# EasyEDA Pro project ProPrj_超级电容组-50F-11S-1P.epro

# Schematic capacitor_protection
Create Date: 2024-03-18; Page Name: P1; Project Name: 超级电容组-50F-11S-1P; Schematic Name: capacitor_protection; Update Date: 2024-04-27; Company: 嘉立创EDA; Page Size: A3; Version: V1.0
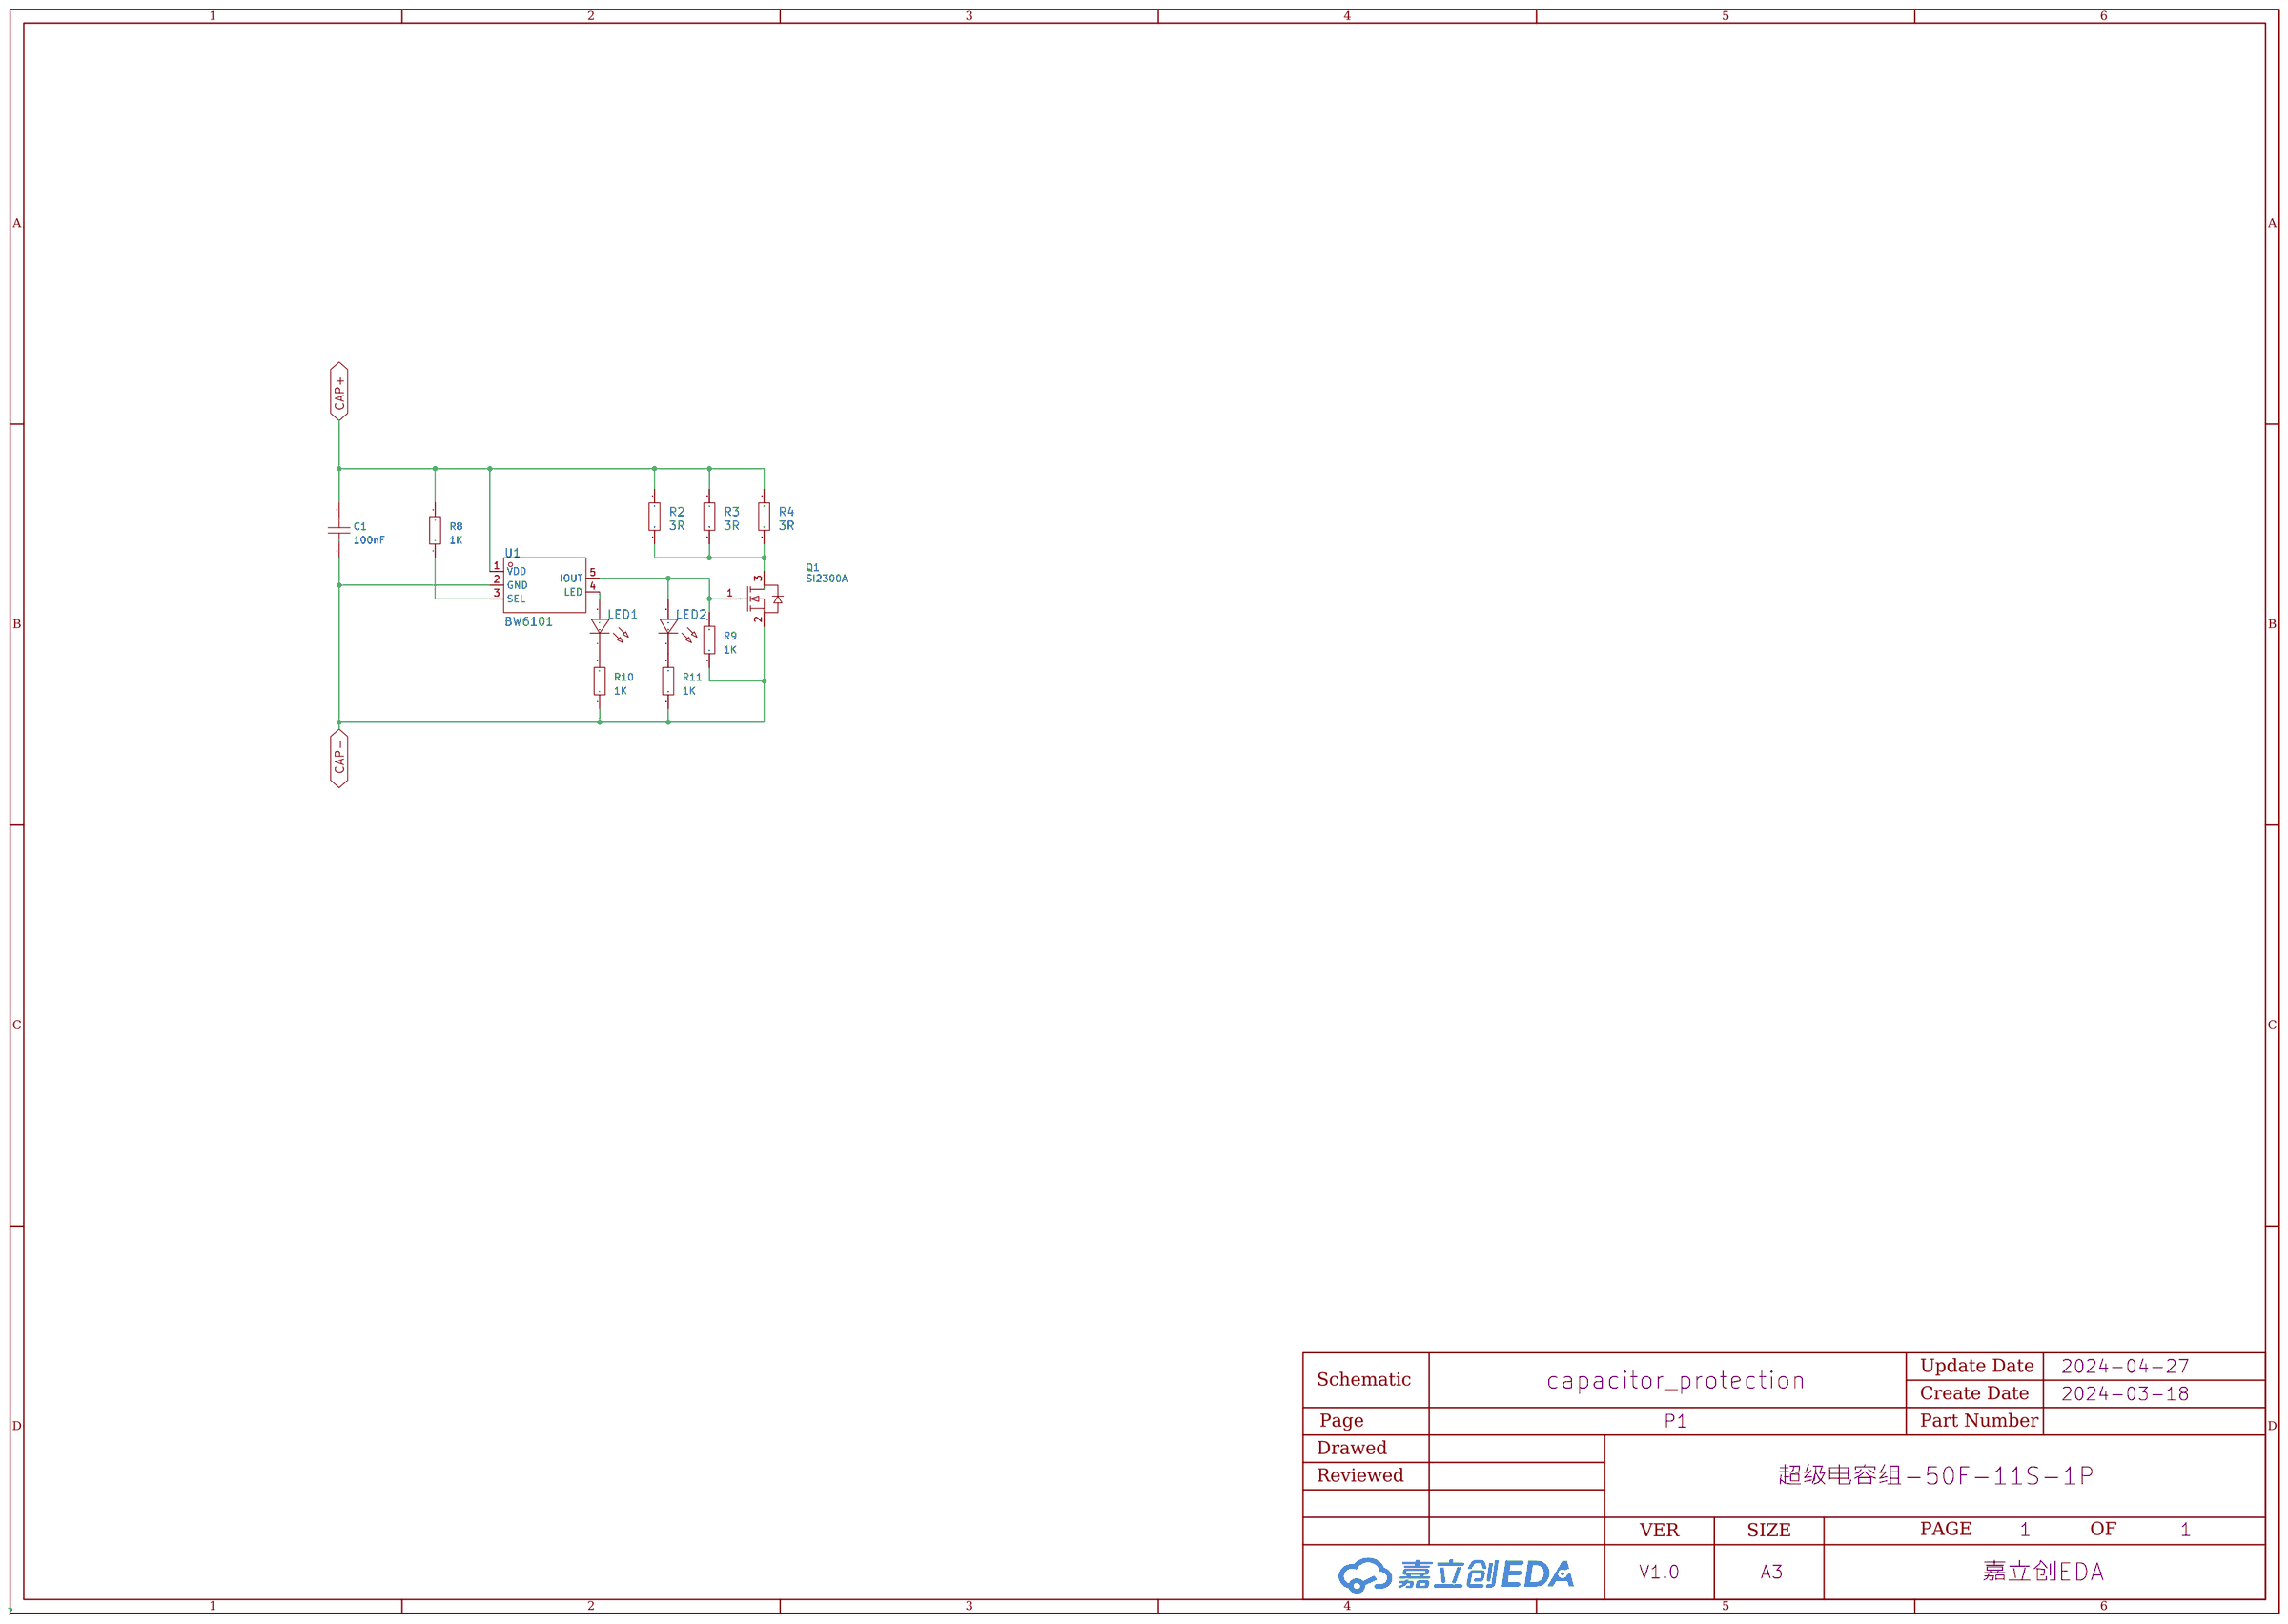
[diagram p0: schematic sheet]

## Parts
C1  100nF  [0603电容-简化]
LED1  -  [LED_0603]
LED2  -  [LED_0603]
Q1  SI2300A  [SOT-23-3_L2.9-W1.5-P1.90-LS2.6-BL]
R2  3R  [R2512_1]
R3  3R  [R2512_1]
R4  3R  [R2512_1]
R8  1K  [R0603]
R9  1K  [R0603]
R10  1K  [R0603]
R11  1K  [R0603]
U1  BW6101  [SOT-23-5_L2.9-W1.6-P0.95-LS2.8-BL_1]

## Library data of the parts
C1 = CC0603KRX7R9BB104: 容值:100nF;精度:±10%;额定电压:50V;材质(温度系数):X7R;; LCSC Part Name: 100nF ±10% 50V; Supplier Part: C14663; Manufacturer: YAGEO(国巨); Supplier Footprint: 0603; JLCPCB Part Class: Basic Part; Datasheet: https://atta.szlcsc.com/upload/public/pdf/source/20180910/C282072_33301C7F631E79921B82A8DAC6BCC5B3.pdf; Supplier: LCSC; Tolerance: ±10%; Voltage Rated: 50V; Temperature Coefficient: X7R
LED1 LED2 = LED_0603-R: Supplier Footprint: 0603
Q1 = SI2300A: Supplier Part: C347480; Manufacturer: UMW(广东友台半导体); Supplier Footprint: SOT-23; JLCPCB Part Class: Extended Part; Datasheet: https://atta.szlcsc.com/upload/public/pdf/source/20190109/C347480_B3D6AA9FA12487304E2E565AB1CA419C.pdf; Supplier: LCSC
R2-R4 = 25121WJ047JT4E_1: Supplier: LCSC; Manufacturer: UniOhm; Manufacturer Part: 25121WJ047JT4E; Supplier Part: C25489; Resistance: 4.7; JLCPCB Part Class: Extended Part
R8-R11 = Res_0603: Supplier Footprint: 0603
U1 = BW6101_1: Supplier: LCSC; Supplier Part: C2835089; Manufacturer: null; JLCPCB Part Class: Extended Part

## Nets
CAP+: C1.2 R2.1 R3.1 R4.1 R8.2 U1.1(VDD)
CAP-: C1.1 Q1.2(S) R9.1 R10.1 R11.1 U1.2(GND)
Net-(LED1-1): LED1.1(C) R10.2
Net-(LED1-2): LED1.2(A) U1.4(LED)
Net-(LED2-1): LED2.1(C) R11.2
Net-(LED2-2): LED2.2(A) Q1.1(G) R9.2 U1.5(IOUT)
Net-(Q1-3): Q1.3(D) R2.2 R3.2 R4.2
Net-(R8-1): R8.1 U1.3(SEL)

# Schematic Schematic1
Create Date: 2024-03-18; Page Name: P1; Project Name: 超级电容组-50F-11S-1P; Schematic Name: Schematic1; Update Date: 2024-04-17; Company: 嘉立创EDA; Drawed: Welt; Page Size: A4; Version: V1.0
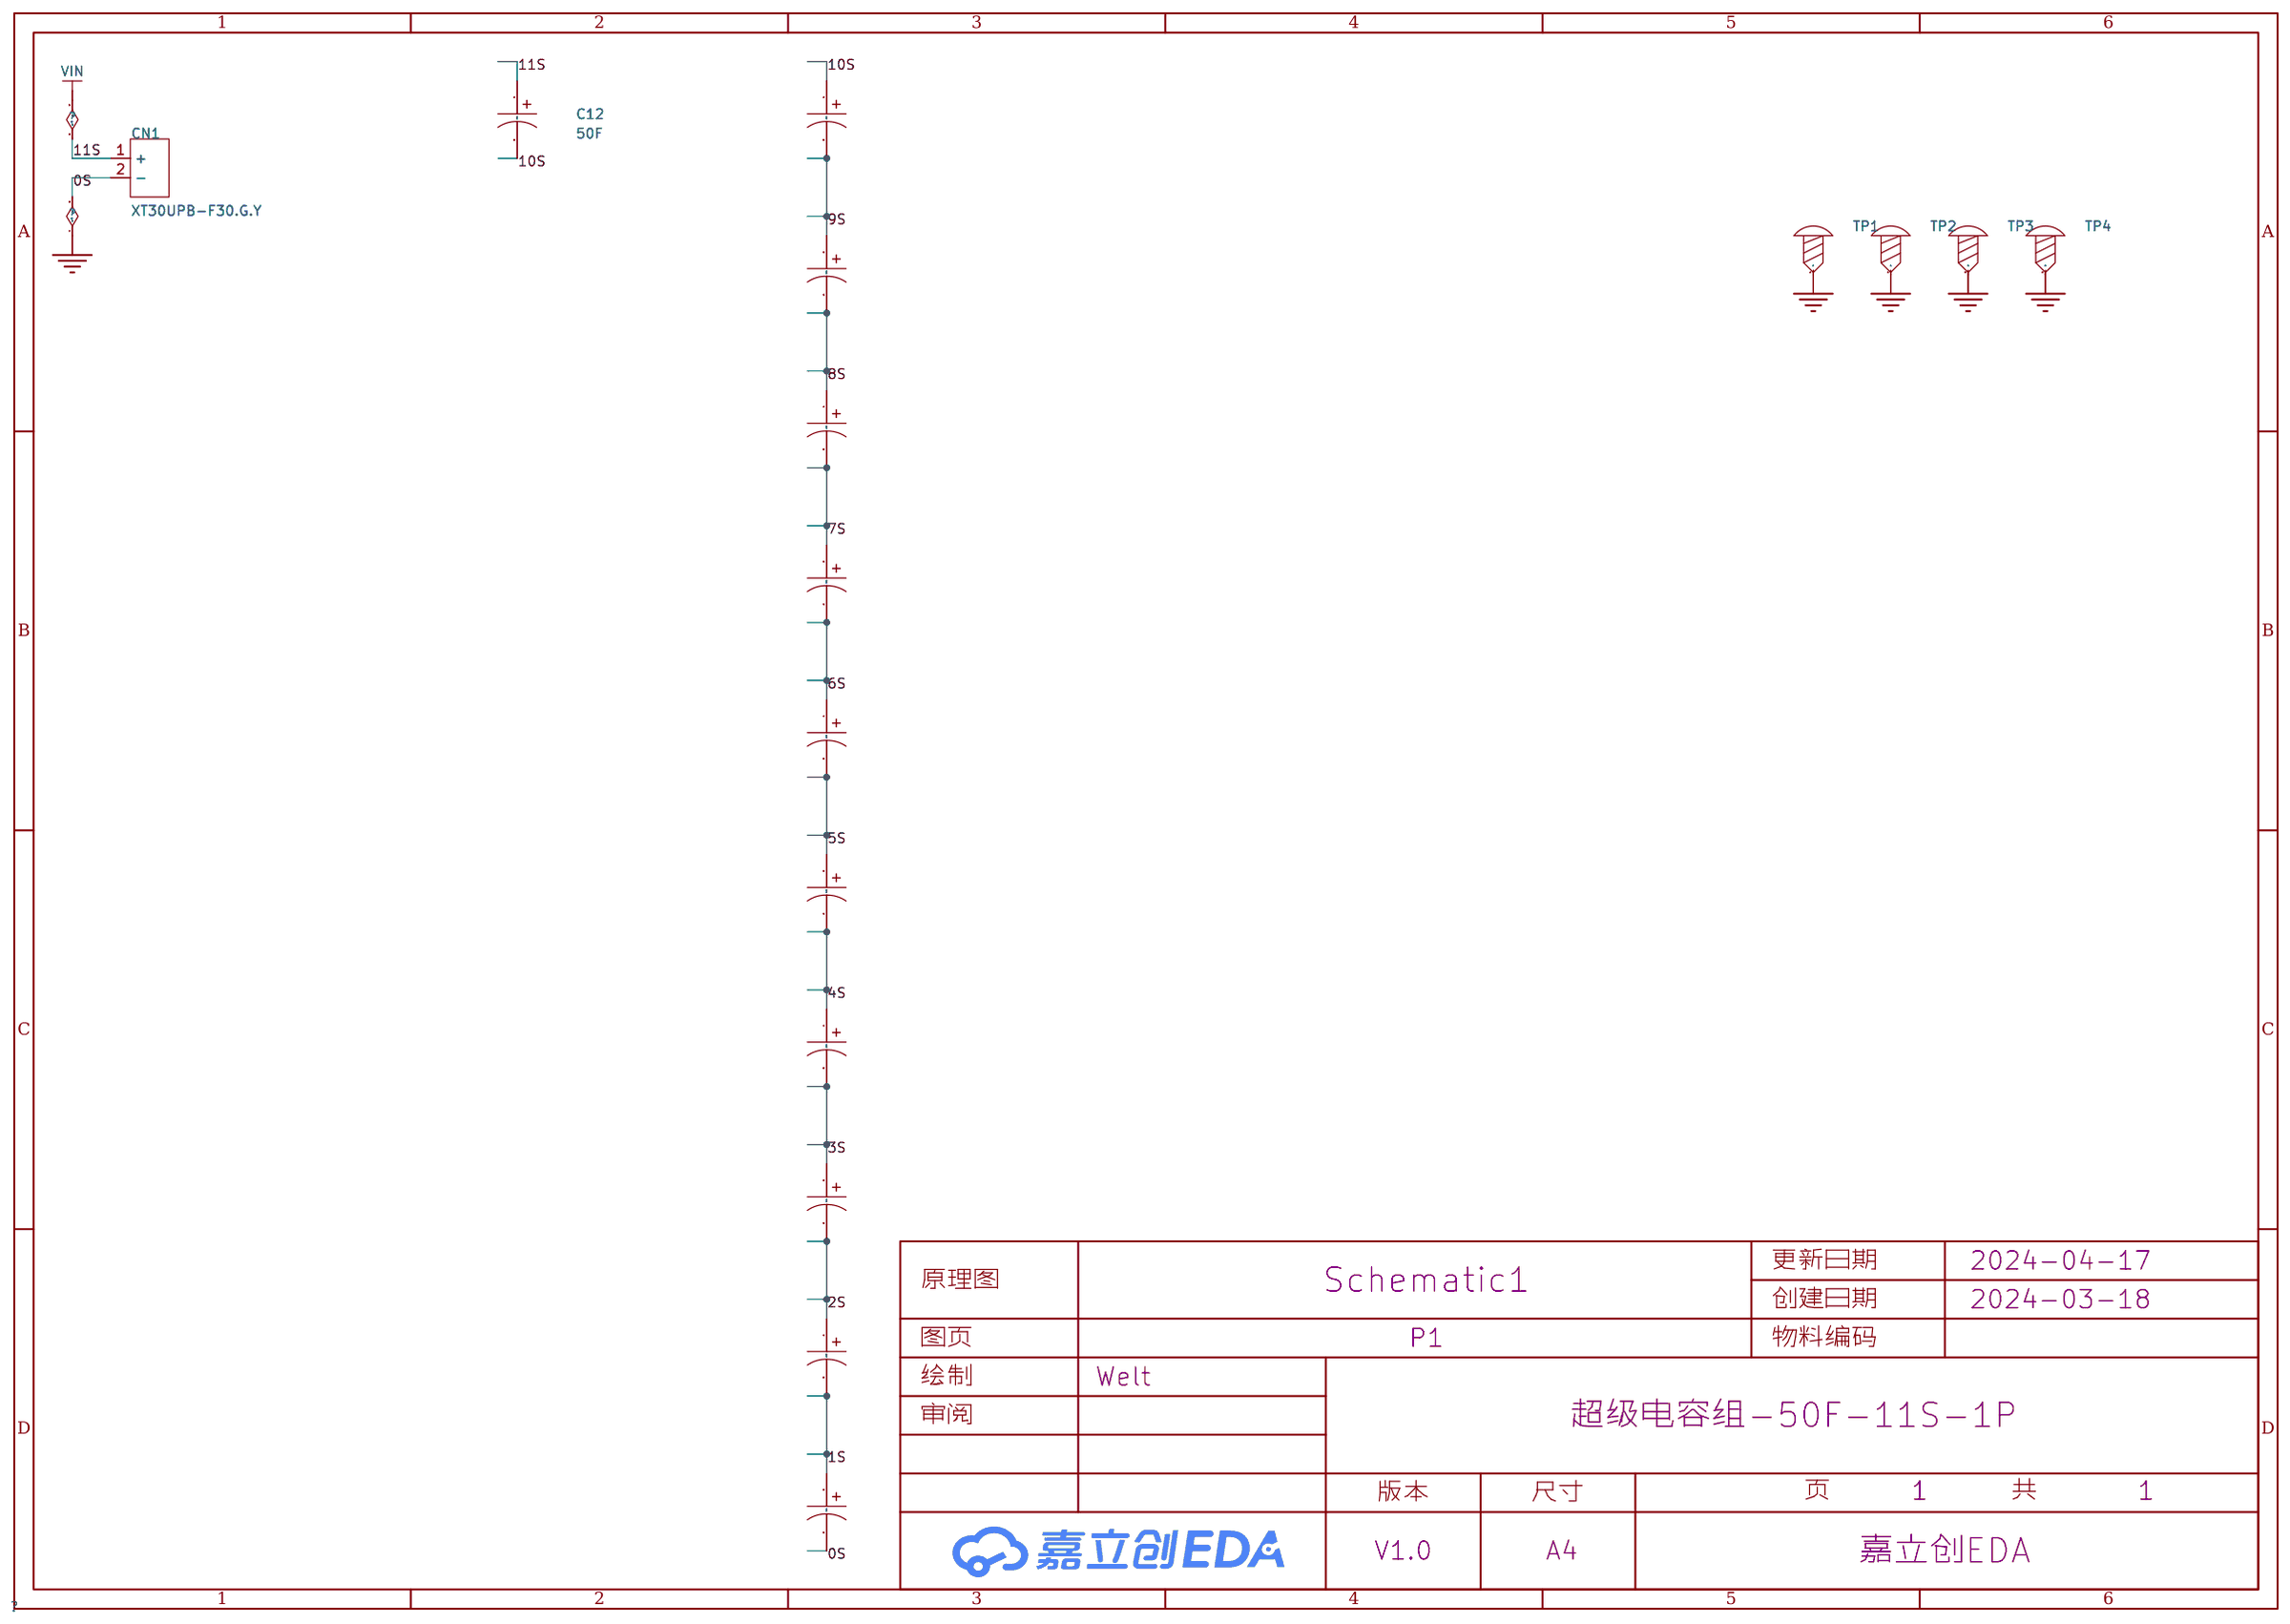
[diagram p1: schematic sheet]

## Parts
C12  50F  [CAP-TH_BD18.0-P7.50-D0.8-FD]
C13  50F  [CAP-TH_BD18.0-P7.50-D0.8-FD]
C14  50F  [CAP-TH_BD18.0-P7.50-D0.8-FD]
C15  50F  [CAP-TH_BD18.0-P7.50-D0.8-FD]
C16  50F  [CAP-TH_BD18.0-P7.50-D0.8-FD]
C17  50F  [CAP-TH_BD18.0-P7.50-D0.8-FD]
C18  50F  [CAP-TH_BD18.0-P7.50-D0.8-FD]
C19  50F  [CAP-TH_BD18.0-P7.50-D0.8-FD]
C20  50F  [CAP-TH_BD18.0-P7.50-D0.8-FD]
C21  50F  [CAP-TH_BD18.0-P7.50-D0.8-FD]
C22  50F  [CAP-TH_BD18.0-P7.50-D0.8-FD]
CBB1  da6ec1b7f8e14e25ba4974c55708ed14
CBB2  da6ec1b7f8e14e25ba4974c55708ed14
CBB3  da6ec1b7f8e14e25ba4974c55708ed14
CBB4  da6ec1b7f8e14e25ba4974c55708ed14
CBB5  da6ec1b7f8e14e25ba4974c55708ed14
CBB6  da6ec1b7f8e14e25ba4974c55708ed14
CBB7  da6ec1b7f8e14e25ba4974c55708ed14
CBB8  da6ec1b7f8e14e25ba4974c55708ed14
CBB9  da6ec1b7f8e14e25ba4974c55708ed14
CBB10  da6ec1b7f8e14e25ba4974c55708ed14
CBB11  da6ec1b7f8e14e25ba4974c55708ed14
CN1  XT30UPB-F30.G.Y  [CONN-TH_XT30UPB-F]
TP1  -  [M3泄压焊盘]
TP2  -  [M3泄压焊盘]
TP3  -  [M3泄压焊盘]
TP4  -  [M3泄压焊盘]

## Library data of the parts
C12-C22 = CXHP2R7506R-TWX-M0 2.7V50F: 容值:50F;精度:±20%;额定电压:2.7V;漏电流:110uA@72hrs;等效串联电阻:18mΩ@1kHz;; LCSC Part Name: 50F ±20% 2.7V; Supplier Part: C2925861; Manufacturer: CDA(智烽维); Supplier Footprint: 插件,P=7.5mm; JLCPCB Part Class: Extended Part; Datasheet: https://atta.szlcsc.com/upload/public/pdf/source/20211227/1A134DDAE96ACB50B8B4D21A958B383D.pdf; Supplier: LCSC; Tolerance: ±20%; Rated Voltage: 2.7V; Leakage Current(DCL): 110uA@72hrs; Equivalent Series Resistance(ESR): 18mΩ@1kHz; Lifetime @ Temp: 1500hrs@70℃; Cycle Life Expectancy: 500000次; Operating Temperature: -40℃~+70℃; φD: 18mm; Body Height: 35mm
CN1 = XT30UPB-F30.G.Y: 类别:-;类型1:-;; LCSC Part Name: AMASS(艾迈斯)直立焊板式连接器XT30UPB30-F.G.*; Supplier Part: C108769; Manufacturer: AMASS(艾迈斯); JLCPCB Part Class: Extended Part; Datasheet: https://atta.szlcsc.com/upload/public/pdf/source/20220715/AFD68B9E8B6CA95A7295DBF4AF9325E4.pdf; Supplier: LCSC; Brand: 艾迈斯; Type: 航模插头; Colour: 黄色; RatedVoltage: DC 500V; InterfaceType: 母头; MetalMaterial: 镀金; InsulationMaterial: PA; RatedCurrent: 15A; contact resistance: 0.65mΩ
TP1-TP4 = M3螺丝: Supplier Footprint: 插件

## Nets
GND: C12.1 C12.2 C13.1 C13.2 C14.1 C14.2 C15.1 C15.2 C16.1 C16.2 C17.1 C17.2 C18.1 C18.2 C19.1 C19.2 C20.1 C20.2 C21.1 C21.2 C22.1 C22.2 CBB1.(CAP+) CBB2.(CAP+) CBB3.(CAP+) CBB4.(CAP+) CBB5.(CAP+) CBB6.(CAP+) CBB7.(CAP+) CBB8.(CAP+) CBB9.(CAP+) CBB10.(CAP+) CBB11.(CAP+) CN1.1(+) CN1.2(-) TP1.1 TP2.1 TP3.1 TP4.1

# Schematic Schematic3
Create Date: 2024-04-22; Page Name: P1; Project Name: 超级电容组-50F-11S-1P; Schematic Name: Schematic1_1; Update Date: 2024-04-23; Company: 嘉立创EDA; Drawed: Welt; Page Size: A4; Version: V1.0
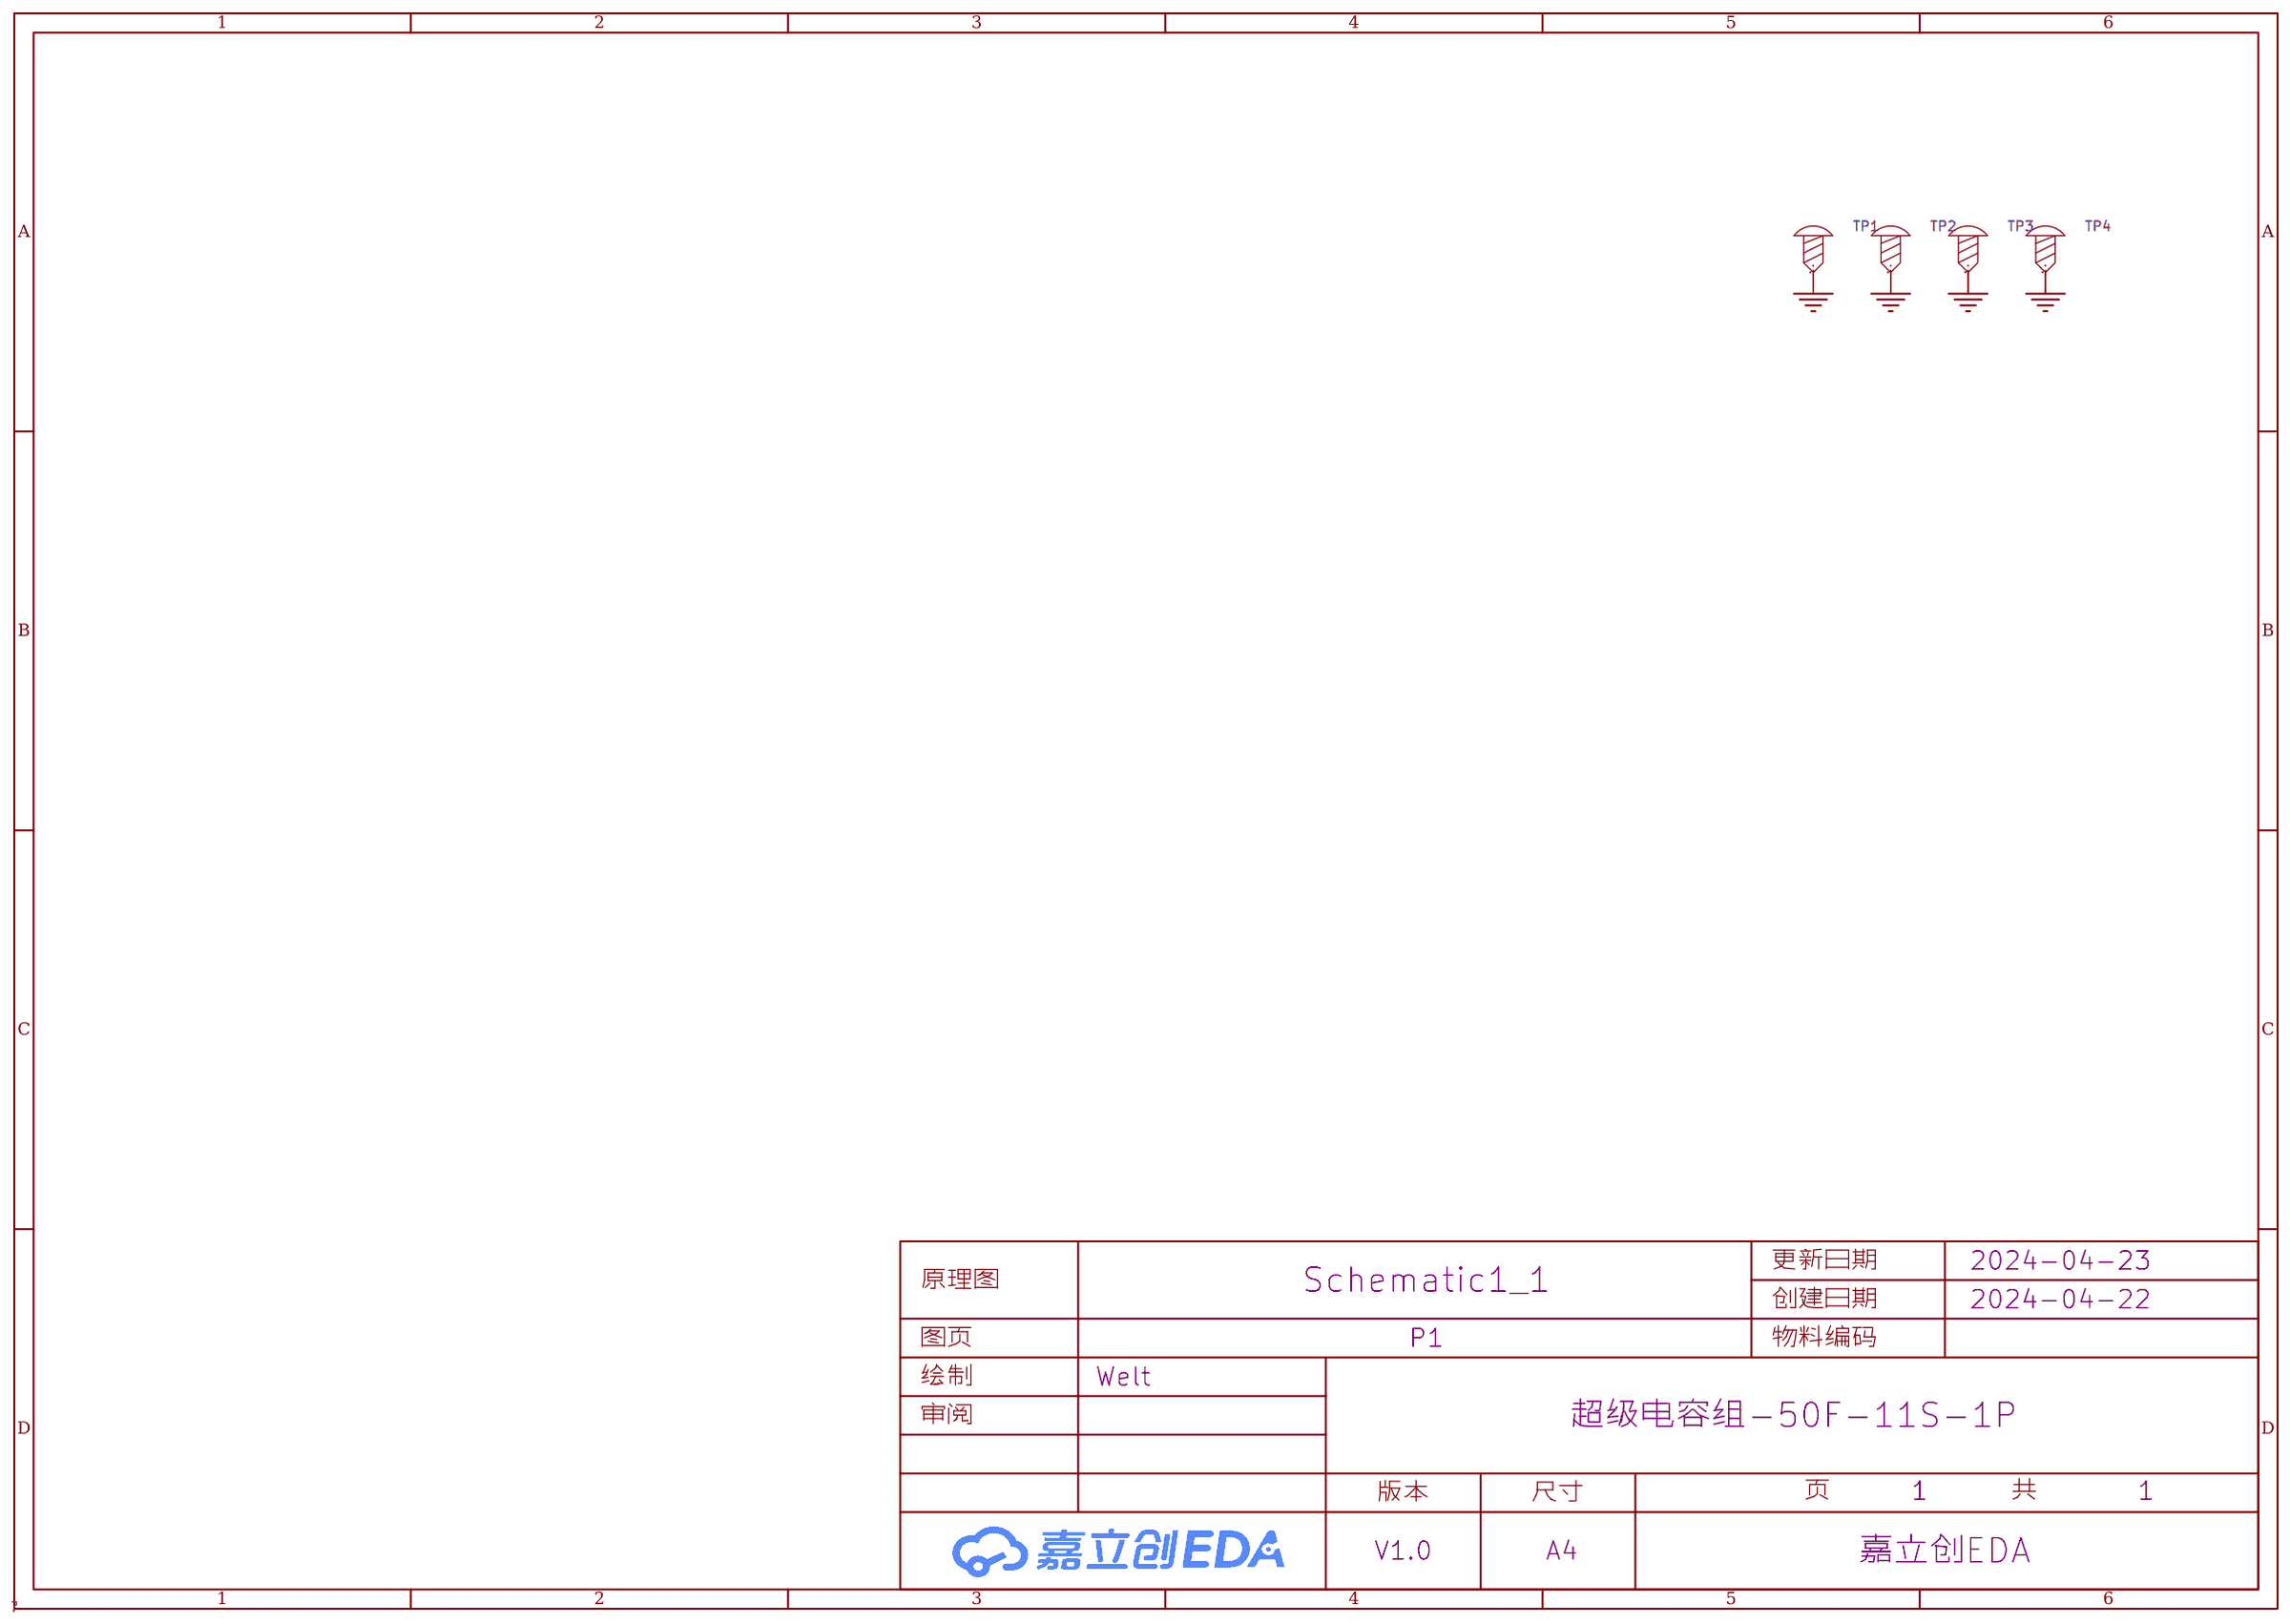
[diagram p2: schematic sheet]

## Parts
TP1  -  [M3泄压焊盘]
TP2  -  [M3泄压焊盘]
TP3  -  [M3泄压焊盘]
TP4  -  [M3泄压焊盘]

## Library data of the parts
TP1-TP4 = M3螺丝: Supplier Footprint: 插件

## Nets
GND: TP1.1 TP2.1 TP3.1 TP4.1

# Board PCB3
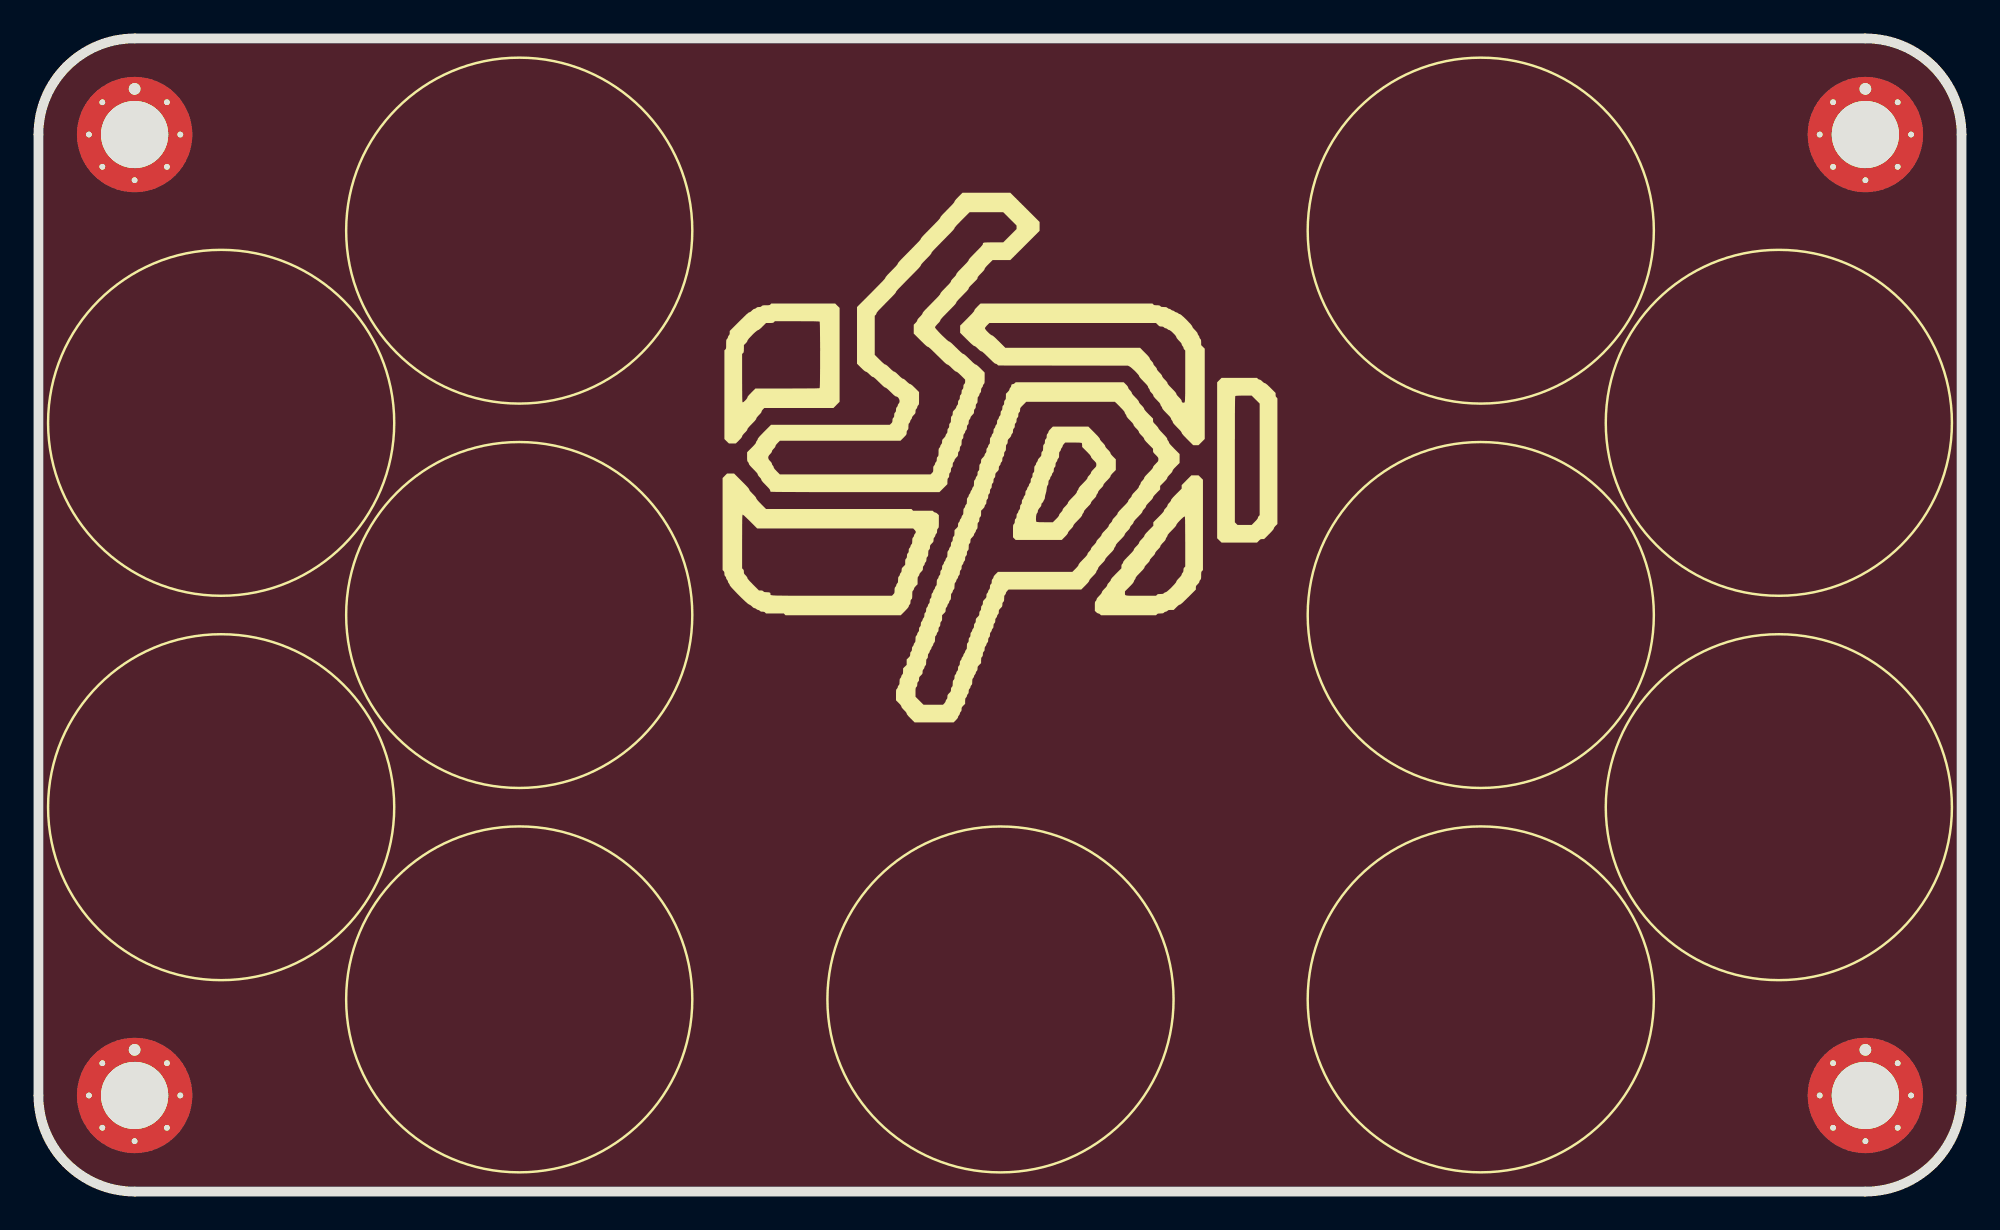
[diagram p3: board, top side]
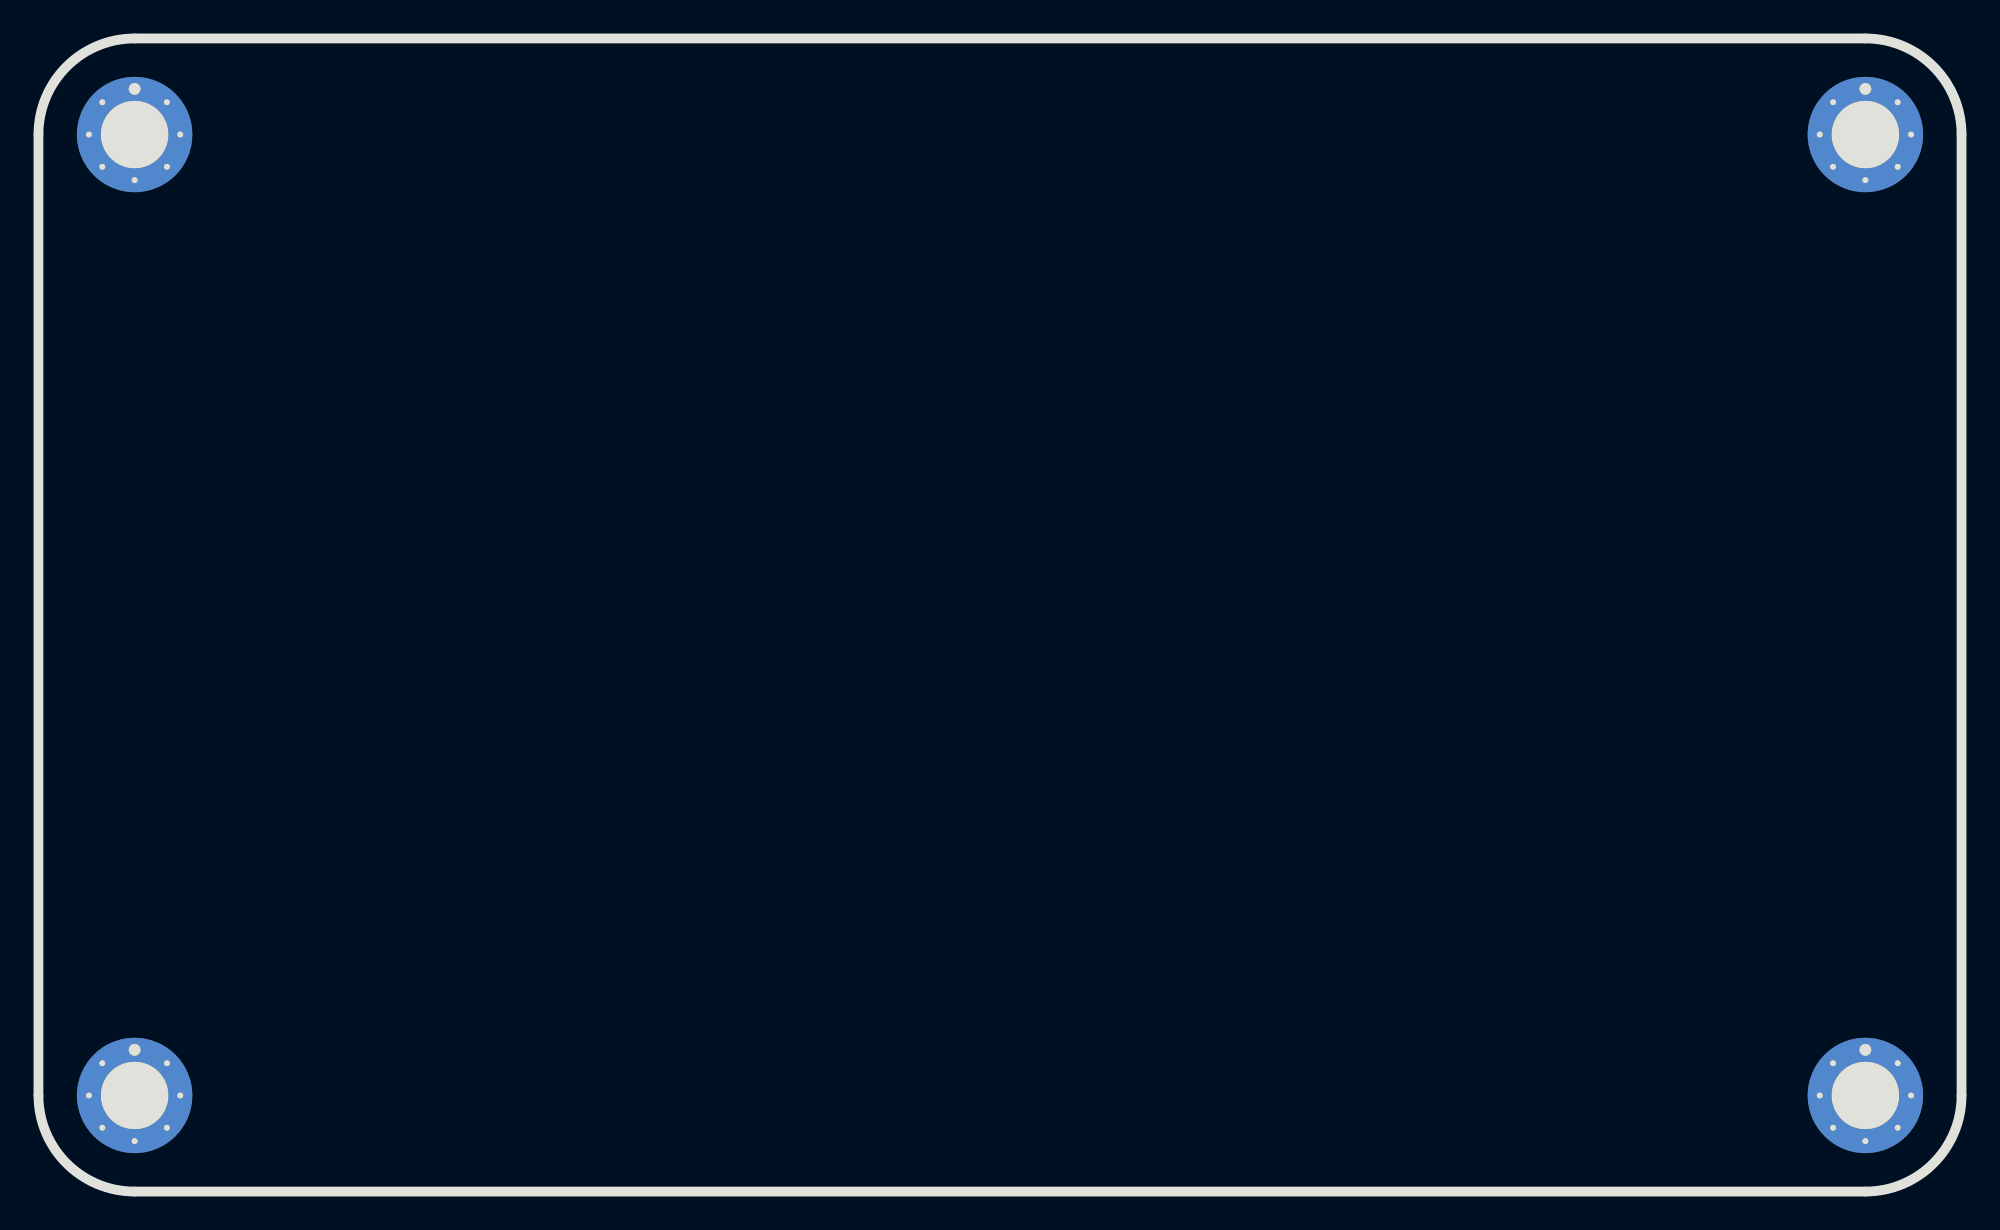
[diagram p4: board, bottom side, seen from below]

Outline 100 x 60 mm; copper layers: Top Layer, Bottom Layer. Coordinates in mm from the lower left corner of the outline.
Outline path: 0,55 0,5 arc(1.46,1.46) 5,0 95,0 arc(98.54,1.46) 100,5 100,55 arc(98.54,58.54) 95,60 5,60 arc(1.46,58.54) 0,55
Stack: Top Layer 0.035mm - / Dielectric1 1.51mm FR4 er 4.5 / Bottom Layer 0.035mm -

## Design rules (mm)
template: 自定义配置
spacing copperThickness1oz (default): track to track 0.102, other pairs 0.152 to 0.3
spacing copperThickness2oz: track to track 0.203, other pairs 0.152 to 0.3
track width copperThickness1oz (default): min 0.127, default 0.254, max 2.54
track width copperThickness2oz: min 0.203, default 0.254, max 2.54
differential pair differentialPair (default): width min 0.127, default 0.254, max 2.54; gap min 0.152, default 0.152
via viaSize (default): diameter min 0.5, default 0.61, max 10; hole min 0.3, default 0.305, max 6.3
net GND uses 电源

## Placement (name value [footprint] x y rotation side)
TP1  -  [M3泄压焊盘]  5 5 0 top
TP2  -  [M3泄压焊盘]  5 55 0 top
TP3  -  [M3泄压焊盘]  95 5 0 top
TP4  -  [M3泄压焊盘]  95 55 0 top

## Footprints (pads in the part's own frame, mm; a bottom-side part is the same pattern mirrored in y, then rotated)
M3泄压焊盘
  round 0.61 hole 0.305: 1(-2.375,0) 1(-1.679,1.679) 1(-1.679,-1.679) 1(0,-2.375) 1(1.679,1.679) 1(1.679,-1.679) 1(2.375,0)
  round 0.61 hole 0.914x0.305: 1(0,2.375)
  round 6 hole 3.5: 1(0,0)

## Nets
As in the schematic.

## Copper pours and planes (outline as drawn; the poured copper is in the pictures)
GND on Top Layer: -10.67,73.18 109.73,73.18 109.73,-12.29 -10.67,-12.29

# Board PCB1
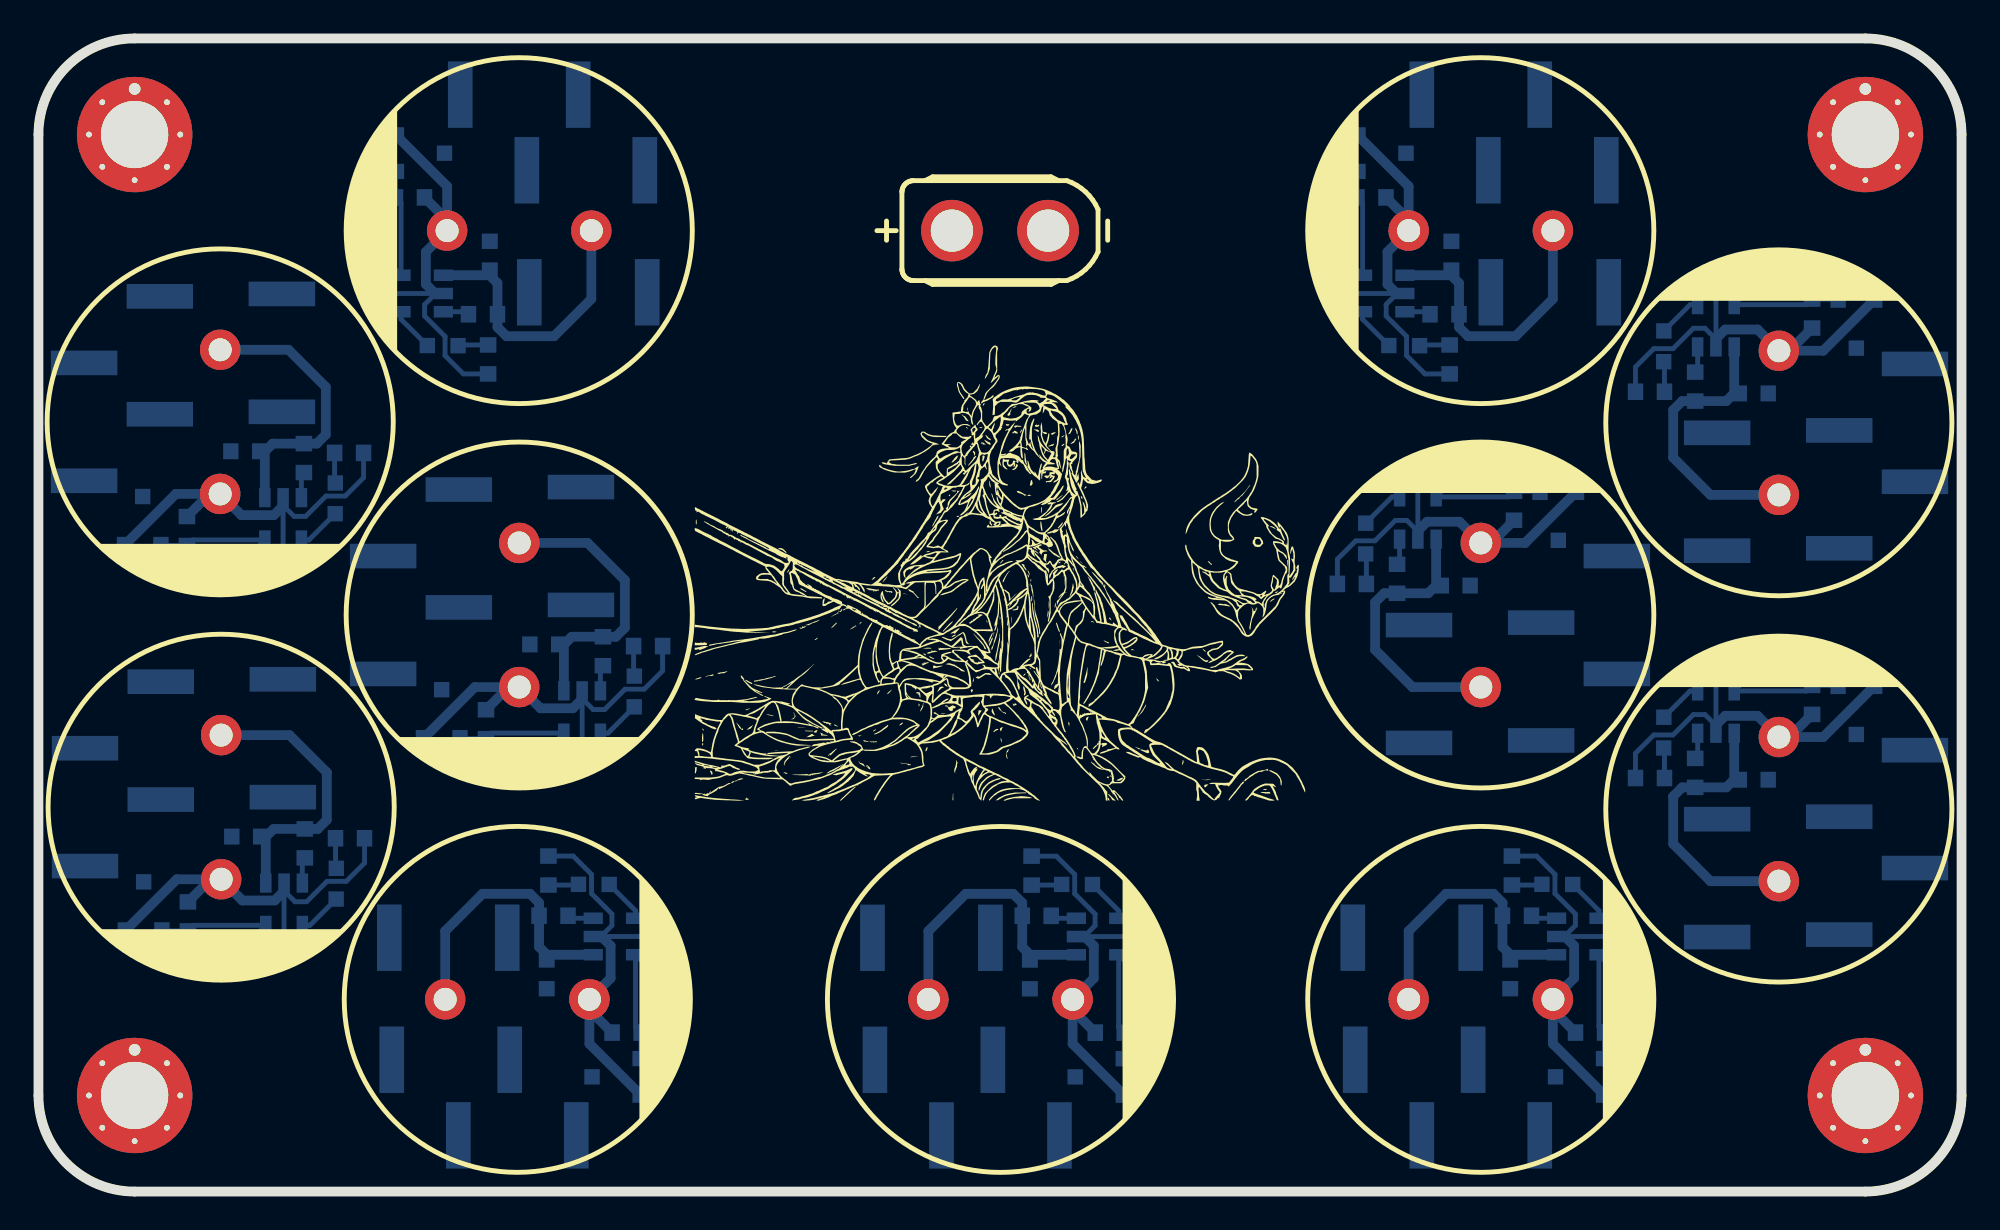
[diagram p5: board, top side]
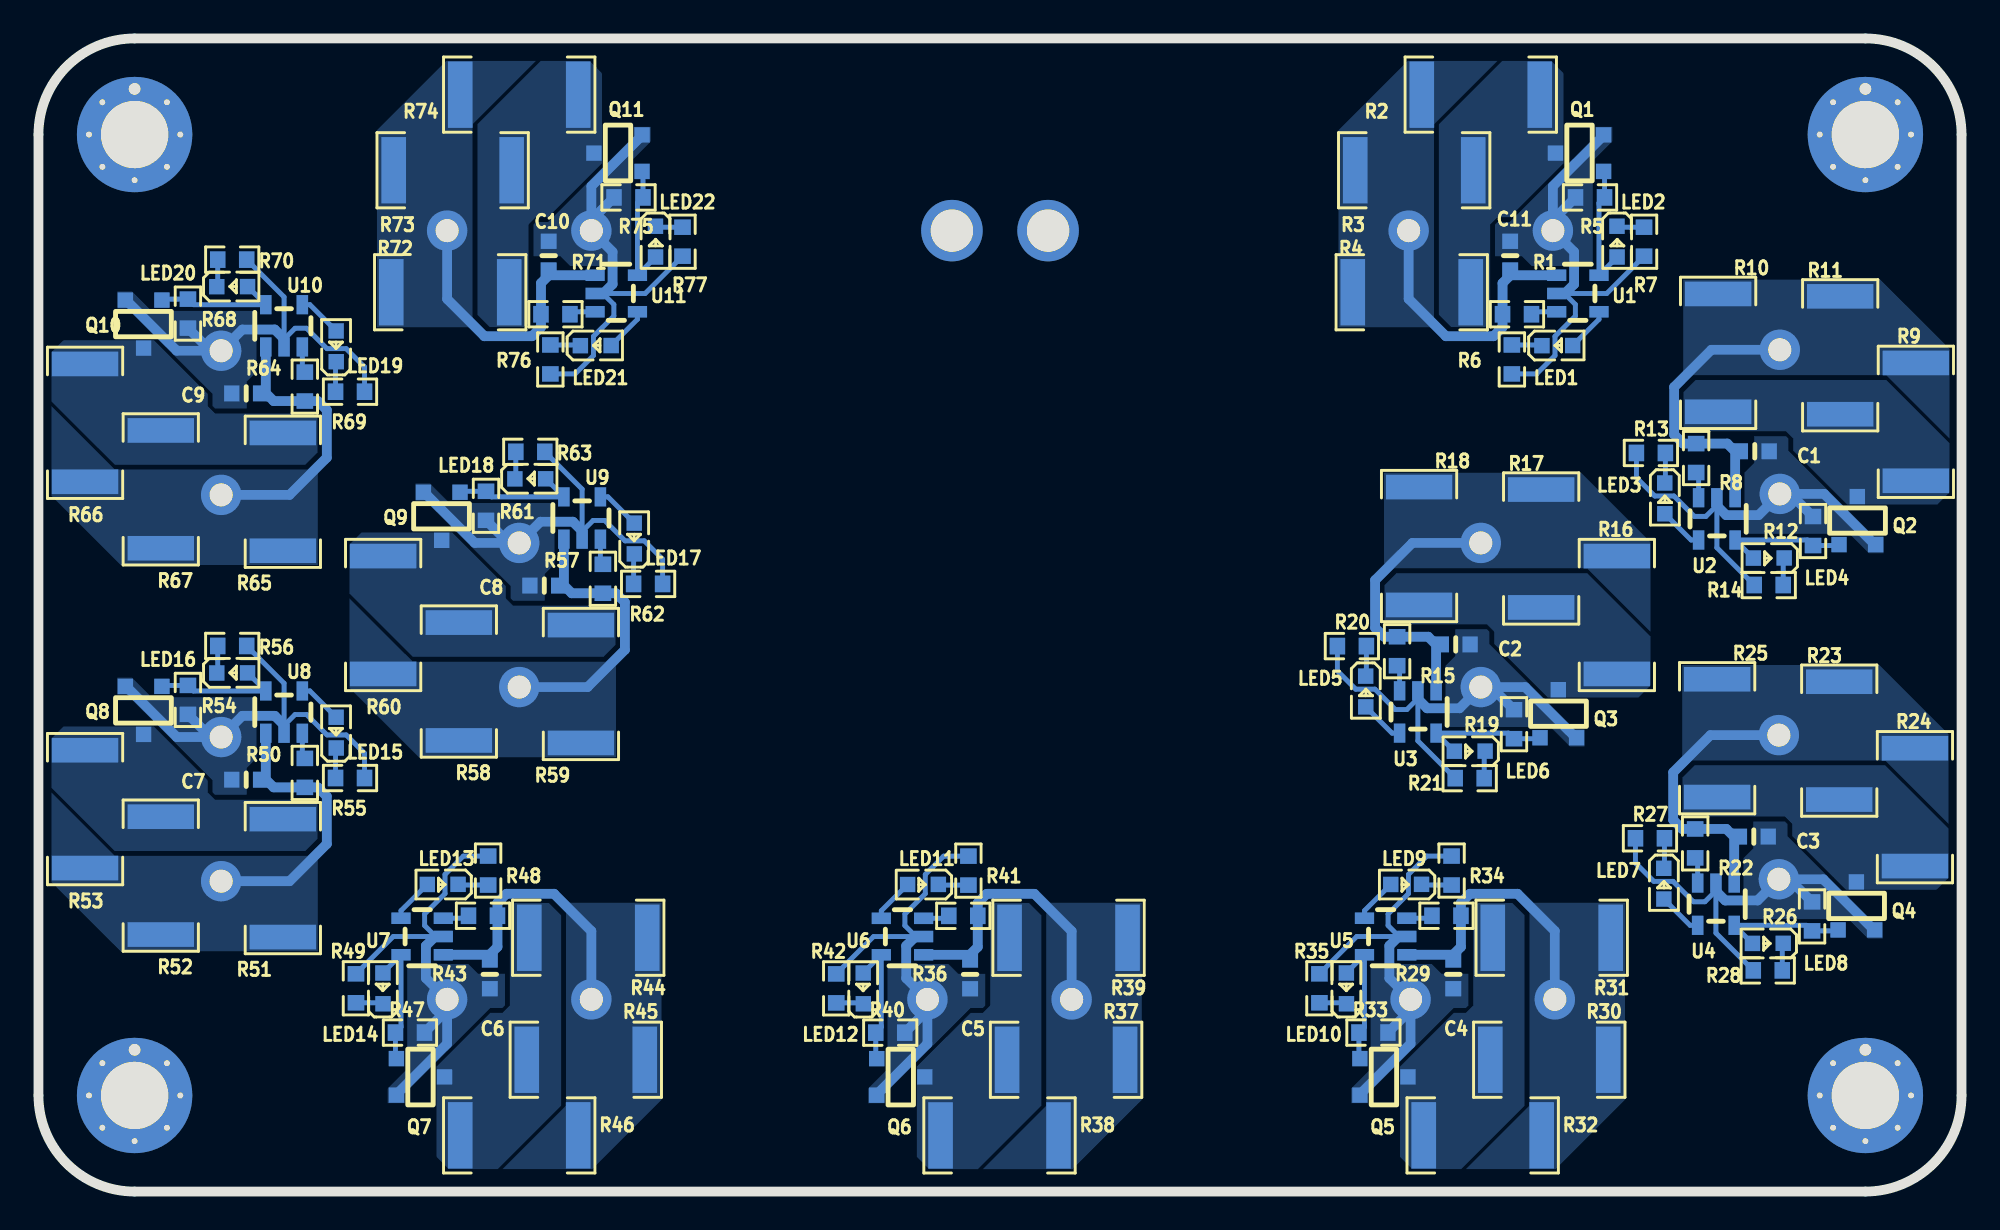
[diagram p6: board, bottom side, seen from below]

Outline 100 x 60 mm; copper layers: Top Layer, Bottom Layer. Coordinates in mm from the lower left corner of the outline.
Outline path: 0,55 0,5 arc(1.46,1.46) 5,0 95,0 arc(98.54,1.46) 100,5 100,55 arc(98.54,58.54) 95,60 5,60 arc(1.46,58.54) 0,55
Stack: Top Layer 0.035mm / Dielectric1 1.51mm FR4 er 4.5 / Bottom Layer 0.035mm

## Design rules (mm)
template: 自定义配置
spacing copperThickness1oz (default): track to track 0.102, other pairs 0.152 to 0.3
spacing copperThickness2oz: track to track 0.203, other pairs 0.152 to 0.3
track width copperThickness1oz (default): min 0.127, default 0.254, max 2.54
track width copperThickness2oz: min 0.203, default 0.254, max 2.54
differential pair differentialPair (default): width min 0.127, default 0.254, max 2.54; gap min 0.152, default 0.152
via viaSize (default): diameter min 0.5, default 0.61, max 10; hole min 0.3, default 0.305, max 6.3
net VIN uses 电源
net 1S uses 电源
net GND uses 电源
net $1I2515/$1N774 uses 电源
net 9S uses 电源
net $1I1517/$1N774 uses 电源
net 8S uses 电源
net $1I2427/$1N774 uses 电源
net 7S uses 电源
net $1I2438/$1N774 uses 电源
net 6S uses 电源
net $1I2449/$1N774 uses 电源
net 5S uses 电源
net $1I2460/$1N774 uses 电源
net 4S uses 电源
net $1I2471/$1N774 uses 电源
net 3S uses 电源
net $1I2482/$1N774 uses 电源
net 2S uses 电源
net $1I2493/$1N774 uses 电源
net $1I2504/$1N774 uses 电源
net $1I11701/$1N774 uses 电源
net 10S uses 电源

## Placement (name value [footprint] x y rotation side)
C1  100nF  [0603电容-简化]  10.75 38.52 0 bottom
C2  100nF  [0603电容-简化]  26.3 28.47 0 bottom
C3  100nF  [0603电容-简化]  10.8 18.47 0 bottom
C4  100nF  [0603电容-简化]  26.43 11.3 90 bottom
C5  100nF  [0603电容-简化]  51.56 11.3 90 bottom
C6  100nF  [0603电容-简化]  76.53 11.3 90 bottom
C7  100nF  [0603电容-简化]  89.2 21.43 180 bottom
C8  100nF  [0603电容-简化]  73.7 31.53 180 bottom
C9  100nF  [0603电容-简化]  89.2 41.53 180 bottom
C10  100nF  [0603电容-简化]  73.47 48.7 270 bottom
C11  100nF  [0603电容-简化]  23.47 48.7 270 bottom
C12  50F  [CAP-TH_BD18.0-P7.50-D0.8-FD]  25 50 180 top
C13  50F  [CAP-TH_BD18.0-P7.50-D0.8-FD]  9.45 40.05 270 top
C14  50F  [CAP-TH_BD18.0-P7.50-D0.8-FD]  25 30 270 top
C15  50F  [CAP-TH_BD18.0-P7.50-D0.8-FD]  9.5 20 270 top
C16  50F  [CAP-TH_BD18.0-P7.50-D0.8-FD]  24.9 10 0 top
C17  50F  [CAP-TH_BD18.0-P7.50-D0.8-FD]  50.03 10 0 top
C18  50F  [CAP-TH_BD18.0-P7.50-D0.8-FD]  75 10 0 top
C19  50F  [CAP-TH_BD18.0-P7.50-D0.8-FD]  90.5 19.9 90 top
C20  50F  [CAP-TH_BD18.0-P7.50-D0.8-FD]  75 30 90 top
C21  50F  [CAP-TH_BD18.0-P7.50-D0.8-FD]  90.5 40 90 top
C22  50F  [CAP-TH_BD18.0-P7.50-D0.8-FD]  75 50 180 top
CN1  XT30UPB-F30.G.Y  [CONN-TH_XT30UPB-F]  50 50 0 top
LED1  -  [LED_0603]  20.97 44.03 180 bottom
LED2  -  [LED_0603]  17.91 49.38 270 bottom
LED3  -  [LED_0603]  15.43 36.02 270 bottom
LED4  -  [LED_0603]  10.07 32.96 0 bottom
LED5  -  [LED_0603]  30.97 25.97 270 bottom
LED6  -  [LED_0603]  25.62 22.91 0 bottom
LED7  -  [LED_0603]  15.48 15.97 270 bottom
LED8  -  [LED_0603]  10.12 12.91 0 bottom
LED9  -  [LED_0603]  28.93 15.97 0 bottom
LED10  -  [LED_0603]  31.99 10.62 90 bottom
LED11  -  [LED_0603]  54.06 15.97 0 bottom
LED12  -  [LED_0603]  57.12 10.62 90 bottom
LED13  -  [LED_0603]  79.03 15.97 0 bottom
LED14  -  [LED_0603]  82.09 10.62 90 bottom
LED15  -  [LED_0603]  84.53 23.93 90 bottom
LED16  -  [LED_0603]  89.88 26.99 180 bottom
LED17  -  [LED_0603]  69.03 34.03 90 bottom
LED18  -  [LED_0603]  74.38 37.09 180 bottom
LED19  -  [LED_0603]  84.53 44.03 90 bottom
LED20  -  [LED_0603]  89.88 47.09 180 bottom
LED21  -  [LED_0603]  70.97 44.03 180 bottom
LED22  -  [LED_0603]  67.91 49.38 270 bottom
Q1  SI2300A  [SOT-23-3_L2.9-W1.5-P1.90-LS2.6-BL]  19.86 54.03 90 bottom
Q2  SI2300A  [SOT-23-3_L2.9-W1.5-P1.90-LS2.6-BL]  5.42 34.91 180 bottom
Q3  SI2300A  [SOT-23-3_L2.9-W1.5-P1.90-LS2.6-BL]  20.97 24.86 180 bottom
Q4  SI2300A  [SOT-23-3_L2.9-W1.5-P1.90-LS2.6-BL]  5.47 14.86 180 bottom
Q5  SI2300A  [SOT-23-3_L2.9-W1.5-P1.90-LS2.6-BL]  30.04 5.97 270 bottom
Q6  SI2300A  [SOT-23-3_L2.9-W1.5-P1.90-LS2.6-BL]  55.16 5.97 270 bottom
Q7  SI2300A  [SOT-23-3_L2.9-W1.5-P1.90-LS2.6-BL]  80.14 5.97 270 bottom
Q8  SI2300A  [SOT-23-3_L2.9-W1.5-P1.90-LS2.6-BL]  94.53 25.04 0 bottom
Q9  SI2300A  [SOT-23-3_L2.9-W1.5-P1.90-LS2.6-BL]  79.03 35.14 0 bottom
Q10  SI2300A  [SOT-23-3_L2.9-W1.5-P1.90-LS2.6-BL]  94.53 45.14 0 bottom
Q11  SI2300A  [SOT-23-3_L2.9-W1.5-P1.90-LS2.6-BL]  69.86 54.03 90 bottom
R1  1K  [R0603]  23.12 45.65 0 bottom
R2  3R  [R2512_1]  25 57.08 180 bottom
R3  3R  [R2512_1]  28.46 53.14 180 bottom
R4  3R  [R2512_1]  28.59 46.79 180 bottom
R5  1K  [R0603]  19.32 51.73 180 bottom
R6  1K  [R0603]  23.38 43.3 90 bottom
R7  1K  [R0603]  16.51 49.42 90 bottom
R8  1K  [R0603]  13.8 38.17 90 bottom
R9  3R  [R2512_1]  2.37 40.05 270 bottom
R10  3R  [R2512_1]  12.66 43.64 270 bottom
R11  3R  [R2512_1]  6.31 43.51 270 bottom
R12  1K  [R0603]  7.72 34.37 270 bottom
R13  1K  [R0603]  16.15 38.43 180 bottom
R14  1K  [R0603]  10.03 31.56 180 bottom
R15  1K  [R0603]  29.35 28.12 90 bottom
R16  3R  [R2512_1]  17.92 30 270 bottom
R17  3R  [R2512_1]  21.86 33.46 270 bottom
R18  3R  [R2512_1]  28.21 33.59 270 bottom
R19  1K  [R0603]  23.27 24.32 270 bottom
R20  1K  [R0603]  31.7 28.38 180 bottom
R21  1K  [R0603]  25.58 21.51 180 bottom
R22  1K  [R0603]  13.85 18.12 90 bottom
R23  3R  [R2512_1]  6.36 23.46 270 bottom
R24  3R  [R2512_1]  2.42 20 270 bottom
R25  3R  [R2512_1]  12.71 23.59 270 bottom
R26  1K  [R0603]  7.77 14.32 270 bottom
R27  1K  [R0603]  16.2 18.38 180 bottom
R28  1K  [R0603]  10.08 11.51 180 bottom
R29  1K  [R0603]  26.79 14.35 180 bottom
R30  3R  [R2512_1]  21.44 6.86 0 bottom
R31  3R  [R2512_1]  21.31 13.21 0 bottom
R32  3R  [R2512_1]  24.9 2.92 0 bottom
R33  1K  [R0603]  30.58 8.27 0 bottom
R34  1K  [R0603]  26.52 16.7 270 bottom
R35  1K  [R0603]  33.39 10.58 270 bottom
R36  1K  [R0603]  51.91 14.35 180 bottom
R37  3R  [R2512_1]  46.56 6.86 0 bottom
R38  3R  [R2512_1]  50.03 2.92 0 bottom
R39  3R  [R2512_1]  46.44 13.2 0 bottom
R40  1K  [R0603]  55.71 8.27 0 bottom
R41  1K  [R0603]  51.64 16.7 270 bottom
R42  1K  [R0603]  58.52 10.57 270 bottom
R43  1K  [R0603]  76.88 14.35 180 bottom
R44  3R  [R2512_1]  71.41 13.21 0 bottom
R45  3R  [R2512_1]  71.54 6.86 0 bottom
R46  3R  [R2512_1]  75 2.92 0 bottom
R47  1K  [R0603]  80.68 8.27 0 bottom
R48  1K  [R0603]  76.62 16.7 270 bottom
R49  1K  [R0603]  83.49 10.58 270 bottom
R50  1K  [R0603]  86.15 21.78 270 bottom
R51  3R  [R2512_1]  87.29 16.31 90 bottom
R52  3R  [R2512_1]  93.64 16.44 90 bottom
R53  3R  [R2512_1]  97.58 19.9 90 bottom
R54  1K  [R0603]  92.23 25.58 90 bottom
R55  1K  [R0603]  83.8 21.52 0 bottom
R56  1K  [R0603]  89.92 28.39 0 bottom
R57  1K  [R0603]  70.65 31.88 270 bottom
R58  3R  [R2512_1]  78.14 26.54 90 bottom
R59  3R  [R2512_1]  71.79 26.41 90 bottom
R60  3R  [R2512_1]  82.08 30 90 bottom
R61  1K  [R0603]  76.73 35.68 90 bottom
R62  1K  [R0603]  68.3 31.62 0 bottom
R63  1K  [R0603]  74.42 38.49 0 bottom
R64  1K  [R0603]  86.15 41.88 270 bottom
R65  3R  [R2512_1]  87.29 36.41 90 bottom
R66  3R  [R2512_1]  97.58 40 90 bottom
R67  3R  [R2512_1]  93.64 36.54 90 bottom
R68  1K  [R0603]  92.23 45.68 90 bottom
R69  1K  [R0603]  83.8 41.62 0 bottom
R70  1K  [R0603]  89.92 48.49 0 bottom
R71  1K  [R0603]  73.12 45.65 0 bottom
R72  3R  [R2512_1]  78.59 46.79 180 bottom
R73  3R  [R2512_1]  78.46 53.14 180 bottom
R74  3R  [R2512_1]  75 57.08 180 bottom
R75  1K  [R0603]  69.32 51.73 180 bottom
R76  1K  [R0603]  73.38 43.3 90 bottom
R77  1K  [R0603]  66.51 49.42 90 bottom
TP1  -  [M3泄压焊盘]  5 5 0 top
TP2  -  [M3泄压焊盘]  5 55 0 top
TP3  -  [M3泄压焊盘]  95 5 0 top
TP4  -  [M3泄压焊盘]  95 55 0 top
U1  BW6101  [SOT-23-5_L2.9-W1.6-P0.95-LS2.8-BL_1]  19.95 46.73 270 bottom
U2  BW6101  [SOT-23-5_L2.9-W1.6-P0.95-LS2.8-BL_1]  12.72 35 0 bottom
U3  BW6101  [SOT-23-5_L2.9-W1.6-P0.95-LS2.8-BL_1]  28.27 24.95 0 bottom
U4  BW6101  [SOT-23-5_L2.9-W1.6-P0.95-LS2.8-BL_1]  12.77 14.95 0 bottom
U5  BW6101  [SOT-23-5_L2.9-W1.6-P0.95-LS2.8-BL_1]  29.95 13.27 90 bottom
U6  BW6101  [SOT-23-5_L2.9-W1.6-P0.95-LS2.8-BL_1]  55.07 13.27 90 bottom
U7  BW6101  [SOT-23-5_L2.9-W1.6-P0.95-LS2.8-BL_1]  80.05 13.27 90 bottom
U8  BW6101  [SOT-23-5_L2.9-W1.6-P0.95-LS2.8-BL_1]  87.23 24.95 180 bottom
U9  BW6101  [SOT-23-5_L2.9-W1.6-P0.95-LS2.8-BL_1]  71.73 35.05 180 bottom
U10  BW6101  [SOT-23-5_L2.9-W1.6-P0.95-LS2.8-BL_1]  87.23 45.05 180 bottom
U11  BW6101  [SOT-23-5_L2.9-W1.6-P0.95-LS2.8-BL_1]  69.95 46.73 270 bottom

## Footprints (pads in the part's own frame, mm; a bottom-side part is the same pattern mirrored in y, then rotated)
0603电容-简化
  rect 0.8x0.83 smd: 1(-0.75,0) 2(0.75,0)
CAP-TH_BD18.0-P7.50-D0.8-FD
  round 2.1 hole 1.2: 1(-3.75,0) 2(3.75,0)
CONN-TH_XT30UPB-F
  round 3.2 hole 2.2: 1(-2.5,0) 2(2.5,0)
LED_0603
  rect 0.8x0.8 smd: 1(-0.851,-0.01) 2(0.75,-0.005)
M3泄压焊盘
  round 0.61 hole 0.305: 1(-2.375,0) 1(-1.679,1.679) 1(-1.679,-1.679) 1(0,-2.375) 1(1.679,1.679) 1(1.679,-1.679) 1(2.375,0)
  round 0.61 hole 0.914x0.305: 1(0,2.375)
  round 6 hole 3.5: 1(0,0)
R0603
  rect 0.806x0.864 smd: 1(-0.753,0) 2(0.753,0)
R2512_1
  rect 1.282x3.456 smd: 1(-3.067,0) 2(3.067,0)
SOT-23-3_L2.9-W1.5-P1.90-LS2.6-BL
  rect 0.8x0.8 smd: 1(-0.95,-1.25) 2(0.95,-1.25) 3(0,1.25)
SOT-23-5_L2.9-W1.6-P0.95-LS2.8-BL_1
  rect 0.6x1 smd: 1(-0.95,-1.1) 2(0,-1.1) 3(0.95,-1.1) 4(0.95,1.1) 5(-0.95,1.1)

## Nets
GND: C10.1 C22.2 CN1.2 Q11.2 R75.1 R76.1 R77.1 TP1.1 TP2.1 TP3.1 TP4.1 U11.2
VIN: C11.2 C12.1 CN1.1 R1.2 R2.1 R3.1 R4.1 U1.1
1S: C9.1 C10.2 C21.2 C22.1 Q10.2 R68.1 R69.1 R70.1 R71.2 R72.1 R73.1 R74.1 U10.2 U11.1
2S: C8.1 C9.2 C20.2 C21.1 Q9.2 R61.1 R62.1 R63.1 R64.2 R65.1 R66.1 R67.1 U9.2 U10.1
3S: C7.1 C8.2 C19.2 C20.1 Q8.2 R54.1 R55.1 R56.1 R57.2 R58.1 R59.1 R60.1 U8.2 U9.1
4S: C6.1 C7.2 C18.2 C19.1 Q7.2 R47.1 R48.1 R49.1 R50.2 R51.1 R52.1 R53.1 U7.2 U8.1
5S: C5.1 C6.2 C17.2 C18.1 Q6.2 R40.1 R41.1 R42.1 R43.2 R44.1 R45.1 R46.1 U6.2 U7.1
6S: C4.1 C5.2 C16.2 C17.1 Q5.2 R33.1 R34.1 R35.1 R36.2 R37.1 R38.1 R39.1 U5.2 U6.1
7S: C3.1 C4.2 C15.2 C16.1 Q4.2 R26.1 R27.1 R28.1 R29.2 R30.1 R31.1 R32.1 U4.2 U5.1
8S: C2.1 C3.2 C14.2 C15.1 Q3.2 R19.1 R20.1 R21.1 R22.2 R23.1 R24.1 R25.1 U3.2 U4.1
9S: C1.1 C2.2 C13.2 C14.1 Q2.2 R12.1 R13.1 R14.1 R15.2 R16.1 R17.1 R18.1 U2.2 U3.1
10S: C1.2 C11.1 C12.2 C13.1 Q1.2 R5.1 R6.1 R7.1 R8.2 R9.1 R10.1 R11.1 U1.2 U2.1
$1I1517/$1N373: R8.1 U2.3
$1I1517/$1N642: LED3.2 U2.4
$1I1517/$1N774: Q2.3 R9.2 R10.2 R11.2
$1I1517/$1N9663: LED4.2 Q2.1 R12.2 U2.5
$1I1517/$1N9820: LED3.1 R13.2
$1I1517/$1N9847: LED4.1 R14.2
$1I2427/$1N373: R15.1 U3.3
$1I2427/$1N642: LED5.2 U3.4
$1I2427/$1N774: Q3.3 R16.2 R17.2 R18.2
$1I2427/$1N9663: LED6.2 Q3.1 R19.2 U3.5
$1I2427/$1N9820: LED5.1 R20.2
$1I2427/$1N9847: LED6.1 R21.2
$1I2438/$1N373: R22.1 U4.3
$1I2438/$1N642: LED7.2 U4.4
$1I2438/$1N774: Q4.3 R23.2 R24.2 R25.2
$1I2438/$1N9663: LED8.2 Q4.1 R26.2 U4.5
$1I2438/$1N9820: LED7.1 R27.2
$1I2438/$1N9847: LED8.1 R28.2
$1I2449/$1N373: R29.1 U5.3
$1I2449/$1N642: LED9.2 U5.4
$1I2449/$1N774: Q5.3 R30.2 R31.2 R32.2
$1I2449/$1N9663: LED10.2 Q5.1 R33.2 U5.5
$1I2449/$1N9820: LED9.1 R34.2
$1I2449/$1N9847: LED10.1 R35.2
$1I2460/$1N373: R36.1 U6.3
$1I2460/$1N642: LED11.2 U6.4
$1I2460/$1N774: Q6.3 R37.2 R38.2 R39.2
$1I2460/$1N9663: LED12.2 Q6.1 R40.2 U6.5
$1I2460/$1N9820: LED11.1 R41.2
$1I2460/$1N9847: LED12.1 R42.2
$1I2471/$1N373: R43.1 U7.3
$1I2471/$1N642: LED13.2 U7.4
$1I2471/$1N774: Q7.3 R44.2 R45.2 R46.2
$1I2471/$1N9663: LED14.2 Q7.1 R47.2 U7.5
$1I2471/$1N9820: LED13.1 R48.2
$1I2471/$1N9847: LED14.1 R49.2
$1I2482/$1N373: R50.1 U8.3
$1I2482/$1N642: LED15.2 U8.4
$1I2482/$1N774: Q8.3 R51.2 R52.2 R53.2
$1I2482/$1N9663: LED16.2 Q8.1 R54.2 U8.5
$1I2482/$1N9820: LED15.1 R55.2
$1I2482/$1N9847: LED16.1 R56.2
$1I2493/$1N373: R57.1 U9.3
$1I2493/$1N642: LED17.2 U9.4
$1I2493/$1N774: Q9.3 R58.2 R59.2 R60.2
$1I2493/$1N9663: LED18.2 Q9.1 R61.2 U9.5
$1I2493/$1N9820: LED17.1 R62.2
$1I2493/$1N9847: LED18.1 R63.2
$1I2504/$1N373: R64.1 U10.3
$1I2504/$1N642: LED19.2 U10.4
$1I2504/$1N774: Q10.3 R65.2 R66.2 R67.2
$1I2504/$1N9663: LED20.2 Q10.1 R68.2 U10.5
$1I2504/$1N9820: LED19.1 R69.2
$1I2504/$1N9847: LED20.1 R70.2
$1I2515/$1N373: R71.1 U11.3
$1I2515/$1N642: LED21.2 U11.4
$1I2515/$1N774: Q11.3 R72.2 R73.2 R74.2
$1I2515/$1N9663: LED22.2 Q11.1 R75.2 U11.5
$1I2515/$1N9820: LED21.1 R76.2
$1I2515/$1N9847: LED22.1 R77.2
$1I11701/$1N373: R1.1 U1.3
$1I11701/$1N642: LED1.2 U1.4
$1I11701/$1N774: Q1.3 R2.2 R3.2 R4.2
$1I11701/$1N9663: LED2.2 Q1.1 R5.2 U1.5
$1I11701/$1N9820: LED1.1 R6.2
$1I11701/$1N9847: LED2.1 R7.2

## Routing (per net, layer and track width the routed paths; a pad name or vN(x,y) marks a point on that pad's centre or on a via; arc(x,y) is an arc through that point)
GND: length 23.6
  Bottom Layer w0.254: 70.65,46.73 70.08,46.16 70.08,45.56 71.14,44.5 71.14,43.5 72.1,42.54 R76.1 ; R77.1 68.45,46.73 70.63,46.73
  Bottom Layer w0.508: 68.58,54.98 71.25,52.31 71.25,50.55 ; 71.25,50.55 C22.2 70.15,48.9 70.15,47.21 70.63,46.73 U11.2 ; 71.25,50.55 R75.1
VIN: length 14.7
  Bottom Layer w0.508: C12.1 28.75,46.44 26.81,44.51 24.34,44.51 23.87,44.97 R1.2 23.87,47.27 23.46,47.68 U1.1
1S: length 38.3
  Bottom Layer w0.254: R70.1 87.23,46.55 87.23,44.37 ; R69.1 83.04,42.9 84,43.86 85,43.86 86.06,44.92 86.66,44.92 87.23,44.35
  Bottom Layer w0.508: R68.1 91.05,43.75 ; 91.05,43.75 C21.2 89.4,44.85 87.71,44.85 87.23,44.37 U10.2 ; 91.05,43.75 92.81,43.75 95.48,46.42 ; C22.1 78.75,46.44 76.81,44.51 74.34,44.51 73.87,44.97 R71.2 73.87,47.27 73.46,47.68 U11.1
2S: length 38.3
  Bottom Layer w0.254: R62.1 67.54,32.9 68.5,33.86 69.5,33.86 70.56,34.92 71.16,34.92 71.73,34.35 ; 71.73,34.37 71.73,36.55 R63.1
  Bottom Layer w0.508: U10.1 88.18,41.54 87.77,41.13 R64.2 85.47,41.13 85.01,40.66 85.01,38.19 86.94,36.25 C21.1 ; 75.55,33.75 77.31,33.75 79.98,36.42 ; 75.55,33.75 C20.2 73.9,34.85 72.21,34.85 71.73,34.37 U9.2 ; 75.55,33.75 R61.1
3S: length 38.3
  Bottom Layer w0.254: R55.1 83.04,22.8 84,23.76 85,23.76 86.06,24.82 86.66,24.82 87.23,24.25 ; 87.23,24.27 87.23,26.45 R56.1
  Bottom Layer w0.508: C20.1 71.44,26.25 69.51,28.19 69.51,30.66 69.97,31.13 R57.2 72.27,31.13 72.68,31.54 U9.1 ; 91.05,23.65 C19.2 89.4,24.75 87.71,24.75 87.23,24.27 U8.2 ; 91.05,23.65 92.81,23.65 95.48,26.32 ; 91.05,23.65 R54.1
4S: length 38.3
  Bottom Layer w0.254: 79.37,13.27 81.55,13.27 R49.1 ; 79.35,13.27 79.92,13.84 79.92,14.44 78.86,15.5 78.86,16.5 77.9,17.46 R48.1
  Bottom Layer w0.508: R47.1 78.75,9.45 ; 78.75,9.45 78.75,7.69 81.42,5.02 ; 78.75,9.45 C18.2 79.85,11.1 79.85,12.79 79.37,13.27 U7.2 ; C19.1 86.94,16.15 85.01,18.09 85.01,20.56 85.47,21.03 R50.2 87.77,21.03 88.18,21.44 U8.1
5S: length 38.3
  Bottom Layer w0.254: R41.1 52.93,17.45 53.88,16.5 53.88,15.5 54.94,14.44 54.94,13.84 54.37,13.27 ; 54.4,13.27 56.57,13.27 R42.1
  Bottom Layer w0.508: 53.78,9.45 53.78,7.69 56.45,5.02 ; 53.78,9.45 R40.1 ; 53.78,9.45 C17.2 54.88,11.1 54.88,12.79 54.4,13.27 U6.2 ; C18.1 71.25,13.56 73.19,15.49 75.66,15.49 76.13,15.03 R43.2 76.13,12.73 76.54,12.32 U7.1
6S: length 38.3
  Bottom Layer w0.254: 29.25,13.27 29.82,13.84 29.82,14.44 28.76,15.5 28.76,16.5 27.8,17.46 R34.1 ; 29.27,13.27 31.45,13.27 R35.1
  Bottom Layer w0.508: U6.1 51.57,12.32 51.16,12.73 51.16,15.02 50.69,15.49 48.21,15.49 46.28,13.55 C17.1 ; R33.1 28.65,9.45 ; 28.65,9.45 28.65,7.69 31.32,5.02 ; 28.65,9.45 C16.2 29.75,11.1 29.75,12.79 29.27,13.27 U5.2
7S: length 38.3
  Bottom Layer w0.254: R27.1 16.96,17.1 16,16.14 15,16.14 13.94,15.08 13.34,15.08 12.77,15.65 ; 12.77,15.63 12.77,13.45 R28.1
  Bottom Layer w0.508: C16.1 21.15,13.56 23.09,15.49 25.56,15.49 26.03,15.03 R29.2 26.03,12.73 26.44,12.32 U5.1 ; R26.1 8.95,16.25 ; 8.95,16.25 C15.2 10.6,15.15 12.29,15.15 12.77,15.63 U4.2 ; 8.95,16.25 7.19,16.25 4.52,13.58
8S: length 38.3
  Bottom Layer w0.254: 28.27,25.63 28.27,23.45 R21.1 ; 28.27,25.65 28.84,25.08 29.44,25.08 30.5,26.14 31.5,26.14 32.46,27.1 R20.1
  Bottom Layer w0.508: 24.45,26.25 22.69,26.25 20.02,23.58 ; 24.45,26.25 R19.1 ; 24.45,26.25 C14.2 26.1,25.15 27.79,25.15 28.27,25.63 U3.2 ; U4.1 11.82,18.46 12.23,18.87 R22.2 14.53,18.87 14.99,19.34 14.99,21.81 13.06,23.75 C15.1
9S: length 38.3
  Bottom Layer w0.254: 12.72,35.7 13.29,35.13 13.89,35.13 14.95,36.19 15.95,36.19 16.91,37.15 R13.1 ; R14.1 12.72,33.5 12.72,35.68
  Bottom Layer w0.508: U2.2 12.72,35.68 12.24,35.2 10.55,35.2 C13.2 8.9,36.3 ; R12.1 8.9,36.3 ; 8.9,36.3 7.14,36.3 4.47,33.63 ; U3.1 27.32,28.46 27.73,28.87 R15.2 30.03,28.87 30.49,29.34 30.49,31.81 28.56,33.75 C14.1
10S: length 38.3
  Bottom Layer w0.254: 20.63,46.73 18.45,46.73 R7.1 ; R6.1 22.1,42.54 21.14,43.5 21.14,44.5 20.08,45.56 20.08,46.16 20.65,46.73
  Bottom Layer w0.508: 18.58,54.98 21.25,52.31 21.25,50.55 ; U1.2 20.63,46.73 20.15,47.21 20.15,48.9 C12.2 21.25,50.55 ; R5.1 21.25,50.55 ; U2.1 11.77,38.51 12.18,38.92 14.48,38.92 14.94,39.39 14.94,41.86 13.01,43.8 C13.1
$1I1517/$1N373: length 1.4
  Bottom Layer w0.254: U2.3 13.67,37.28 R8.1
$1I1517/$1N642: length 2.3
  Bottom Layer w0.254: LED3.2 14.06,33.9 U2.4
$1I1517/$1N9663: length 6.9
  Bottom Layer w0.254: 6.37,33.63 6.38,33.61 R12.2 8.01,33.9 U2.5 10.83,32.96 LED4.2
$1I1517/$1N9820: length 1.6
  Bottom Layer w0.254: LED3.1 15.4,36.91 R13.2
$1I1517/$1N9847: length 1.4
  Bottom Layer w0.254: LED4.1 9.27,32.92 R14.2
$1I2427/$1N373: length 1.4
  Bottom Layer w0.254: U3.3 29.22,27.23 R15.1
$1I2427/$1N642: length 2.3
  Bottom Layer w0.254: 30.98,25.22 29.61,23.85 29.22,23.85
$1I2427/$1N9663: length 6.9
  Bottom Layer w0.254: 21.92,23.58 21.93,23.56 R19.2 23.56,23.85 27.32,23.85 26.38,22.91 LED6.2
$1I2427/$1N9820: length 1.6
  Bottom Layer w0.254: R20.2 30.95,26.86 LED5.1
$1I2427/$1N9847: length 1.4
  Bottom Layer w0.254: LED6.1 24.82,22.87 R21.2
$1I2438/$1N373: length 1.4
  Bottom Layer w0.254: R22.1 13.72,17.23 U4.3
$1I2438/$1N642: length 2.3
  Bottom Layer w0.254: LED7.2 14.11,13.85 13.72,13.85
$1I2438/$1N9663: length 6.9
  Bottom Layer w0.254: 6.42,13.58 6.43,13.56 R26.2 8.06,13.85 11.82,13.85 10.88,12.91 LED8.2
$1I2438/$1N9820: length 1.6
  Bottom Layer w0.254: LED7.1 15.45,16.86 R27.2
$1I2438/$1N9847: length 1.4
  Bottom Layer w0.254: LED8.1 9.32,12.87 R28.2
$1I2449/$1N373: length 1.4
  Bottom Layer w0.254: R29.1 27.67,14.22 U5.3
$1I2449/$1N642: length 2.3
  Bottom Layer w0.254: LED9.2 31.05,14.61 U5.4
$1I2449/$1N9663: length 6.9
  Bottom Layer w0.254: 31.99,11.37 31.99,11.38 U5.5 31.05,8.56 R33.2 31.34,6.93 31.32,6.92
$1I2449/$1N9820: length 1.6
  Bottom Layer w0.254: R34.2 28.04,15.95 28.08,15.98
$1I2449/$1N9847: length 1.4
  Bottom Layer w0.254: R35.2 32.03,9.82 LED10.1
$1I2460/$1N373: length 1.4
  Bottom Layer w0.254: U6.3 52.79,14.22 R36.1
$1I2460/$1N642: length 2.3
  Bottom Layer w0.254: U6.4 56.17,14.61 LED11.2
$1I2460/$1N9663: length 6.9
  Bottom Layer w0.254: 56.45,6.92 56.46,6.93 R40.2 56.17,8.56 U6.5 57.11,11.38 LED12.2
$1I2460/$1N9820: length 1.6
  Bottom Layer w0.254: R41.2 53.17,15.95 LED11.1
$1I2460/$1N9847: length 1.4
  Bottom Layer w0.254: LED12.1 57.16,9.82 R42.2
$1I2471/$1N373: length 1.4
  Bottom Layer w0.254: R43.1 77.77,14.22 U7.3
$1I2471/$1N642: length 2.3
  Bottom Layer w0.254: U7.4 81.15,14.61 LED13.2
$1I2471/$1N9663: length 6.9
  Bottom Layer w0.254: 82.09,11.37 82.09,11.38 U7.5 81.15,8.56 R47.2 81.44,6.93 81.42,6.92
$1I2471/$1N9820: length 1.6
  Bottom Layer w0.254: LED13.1 78.14,15.95 R48.2
$1I2471/$1N9847: length 1.4
  Bottom Layer w0.254: R49.2 82.13,9.82 LED14.1
$1I2482/$1N373: length 1.4
  Bottom Layer w0.254: U8.3 86.28,22.67 R50.1
$1I2482/$1N642: length 2.3
  Bottom Layer w0.254: U8.4 85.89,26.05 LED15.2
$1I2482/$1N9663: length 6.9
  Bottom Layer w0.254: LED16.2 89.12,26.99 U8.5 91.94,26.05 R54.2 93.57,26.34 93.58,26.32
$1I2482/$1N9820: length 1.6
  Bottom Layer w0.254: R55.2 84.55,23.04 LED15.1
$1I2482/$1N9847: length 1.4
  Bottom Layer w0.254: 90.73,26.98 90.68,27.03 R56.2
$1I2493/$1N373: length 1.4
  Bottom Layer w0.254: R57.1 70.78,32.77 U9.3
$1I2493/$1N642: length 2.3
  Bottom Layer w0.254: LED17.2 70.39,36.15 70.78,36.15
$1I2493/$1N9663: length 6.9
  Bottom Layer w0.254: LED18.2 73.62,37.09 72.68,36.15 76.44,36.15 R61.2 78.07,36.44 78.08,36.42
$1I2493/$1N9820: length 1.6
  Bottom Layer w0.254: LED17.1 69.05,33.14 R62.2
$1I2493/$1N9847: length 1.4
  Bottom Layer w0.254: LED18.1 75.18,37.13 R63.2
$1I2504/$1N373: length 1.4
  Bottom Layer w0.254: U10.3 86.28,42.77 R64.1
$1I2504/$1N642: length 2.3
  Bottom Layer w0.254: LED19.2 85.89,46.15 86.28,46.15
$1I2504/$1N9663: length 6.9
  Bottom Layer w0.254: LED20.2 89.12,47.09 88.18,46.15 91.94,46.15 R68.2 93.57,46.44 93.58,46.42
$1I2504/$1N9820: length 1.6
  Bottom Layer w0.254: LED19.1 84.55,43.14 R69.2
$1I2504/$1N9847: length 1.4
  Bottom Layer w0.254: LED20.1 90.68,47.13 R70.2
$1I2515/$1N373: length 1.4
  Bottom Layer w0.254: U11.3 72.23,45.78 R71.1
$1I2515/$1N642: length 2.3
  Bottom Layer w0.254: U11.4 68.85,45.39 LED21.2
$1I2515/$1N9663: length 6.9
  Bottom Layer w0.254: 68.58,53.08 68.56,53.07 R75.2 68.85,51.44 U11.5 67.91,48.62 LED22.2
$1I2515/$1N9820: length 1.6
  Bottom Layer w0.254: R76.2 71.86,44.05 LED21.1
$1I2515/$1N9847: length 1.4
  Bottom Layer w0.254: LED22.1 67.87,50.18 R77.2
$1I11701/$1N373: length 1.4
  Bottom Layer w0.254: U1.3 22.23,45.78 R1.1
$1I11701/$1N642: length 2.3
  Bottom Layer w0.254: LED1.2 18.85,45.39 U1.4
$1I11701/$1N9663: length 6.9
  Bottom Layer w0.254: LED2.2 17.91,48.62 U1.5 18.85,51.44 R5.2 18.56,53.07 18.58,53.08
$1I11701/$1N9820: length 1.6
  Bottom Layer w0.254: R6.2 21.86,44.05 LED1.1
$1I11701/$1N9847: length 1.4
  Bottom Layer w0.254: R7.2 17.87,50.18 LED2.1

## Copper pours and planes (outline as drawn; the poured copper is in the pictures)
GND on Top Layer: 74.78,53.75 74.78,40 66,40 66,20.01 50.03,20.01 50.03,53.75
GND on Top Layer: -7.75,64.42 107.19,64.42 107.19,-8.86 -7.75,-8.86
GND on Bottom Layer: 68.16,55.4 74.26,55.4 74.26,48.16 68.16,48.16
GND on Bottom Layer: -4,62.32 110.93,62.32 110.93,-10.96 -4,-10.96
VIN on Top Layer: 25.23,53.75 25.23,40 34,40 34,20.01 49.97,20.01 49.97,53.75
VIN on Bottom Layer: 24.13,58.83 32.4,58.83 32.4,44.97 24.13,44.97
1S on Top Layer: 75,40 94.18,40 94.18,49.05 84.07,49.05 84.07,53.75 75,53.75
1S on Bottom Layer: 74.13,58.83 82.4,58.83 82.4,44.97 74.13,44.97
1S on Bottom Layer: 88.66,46.84 95.9,46.84 95.9,40.74 88.66,40.74
2S on Top Layer: 66,40 94.18,40 94.18,30 66,30
2S on Bottom Layer: 85.47,40.87 99.33,40.87 99.33,32.6 85.47,32.6
2S on Bottom Layer: 73.16,36.84 80.4,36.84 80.4,30.74 73.16,30.74
3S on Top Layer: 66,30 94.24,30 94.24,20 66,20
3S on Bottom Layer: 69.97,30.87 83.83,30.87 83.83,22.6 69.97,22.6
3S on Bottom Layer: 88.66,26.74 95.9,26.74 95.9,20.64 88.66,20.64
4S on Top Layer: 75.06,20 94.24,20 94.24,10.95 84.14,10.95 84.14,6.25 75.06,6.25
4S on Bottom Layer: 75.74,11.84 81.84,11.84 81.84,4.6 75.74,4.6
4S on Bottom Layer: 85.47,20.77 99.33,20.77 99.33,12.5 85.47,12.5
5S on Top Layer: 50.03,20.01 75.06,20.01 75.06,6.25 50.03,6.25
5S on Bottom Layer: 67.6,15.03 75.87,15.03 75.87,1.17 67.6,1.17
5S on Bottom Layer: 50.77,11.84 56.86,11.84 56.86,4.6 50.77,4.6
6S on Top Layer: 24.94,20.01 49.97,20.01 49.97,6.25 24.94,6.25
6S on Bottom Layer: 42.63,15.02 50.9,15.02 50.9,1.17 42.63,1.17
6S on Bottom Layer: 25.64,11.84 31.74,11.84 31.74,4.6 25.64,4.6
7S on Top Layer: 24.94,20 5.76,20 5.76,10.95 15.86,10.95 15.86,6.25 24.94,6.25
7S on Bottom Layer: 4.1,19.26 11.34,19.26 11.34,13.16 4.1,13.16
7S on Bottom Layer: 17.5,15.03 25.77,15.03 25.77,1.17 17.5,1.17
8S on Top Layer: 5.76,30 34,30 34,20 5.76,20
8S on Bottom Layer: 19.6,29.26 26.84,29.26 26.84,23.16 19.6,23.16
8S on Bottom Layer: 0.67,27.4 14.53,27.4 14.53,19.13 0.67,19.13
9S on Top Layer: 5.82,40 34,40 34,30 5.82,30
9S on Bottom Layer: 16.17,37.4 30.03,37.4 30.03,29.13 16.17,29.13
9S on Bottom Layer: 4.05,39.31 11.29,39.31 11.29,33.21 4.05,33.21
10S on Top Layer: 25.23,40 5.79,40 5.79,49.05 16.15,49.05 16.15,53.75 25.23,53.75
10S on Bottom Layer: 18.16,55.4 24.26,55.4 24.26,48.16 18.16,48.16
10S on Bottom Layer: 0.62,47.45 14.48,47.45 14.48,39.18 0.62,39.18
$1I1517/$1N774 on Bottom Layer: 0.62,42.23 14.46,42.23 14.46,35.75 0.62,35.75
$1I2427/$1N774 on Bottom Layer: 16.17,32.18 30.01,32.18 30.01,25.7 16.17,25.7
$1I2438/$1N774 on Bottom Layer: 0.67,22.18 14.51,22.18 14.51,15.7 0.67,15.7
$1I2449/$1N774 on Bottom Layer: 22.72,15.01 29.2,15.01 29.2,1.17 22.72,1.17
$1I2460/$1N774 on Bottom Layer: 47.85,15.01 54.32,15.01 54.32,1.17 47.85,1.17
$1I2471/$1N774 on Bottom Layer: 72.82,15.01 79.3,15.01 79.3,1.17 72.82,1.17
$1I2482/$1N774 on Bottom Layer: 85.49,24.2 99.33,24.2 99.33,17.72 85.49,17.72
$1I2493/$1N774 on Bottom Layer: 69.99,34.3 83.83,34.3 83.83,27.82 69.99,27.82
$1I2504/$1N774 on Bottom Layer: 85.49,44.3 99.33,44.3 99.33,37.82 85.49,37.82
$1I2515/$1N774 on Bottom Layer: 70.7,58.83 77.18,58.83 77.18,44.99 70.7,44.99
$1I11701/$1N774 on Bottom Layer: 20.7,58.83 27.18,58.83 27.18,44.99 20.7,44.99
